# Altium project psat_mboard.PrjPcb
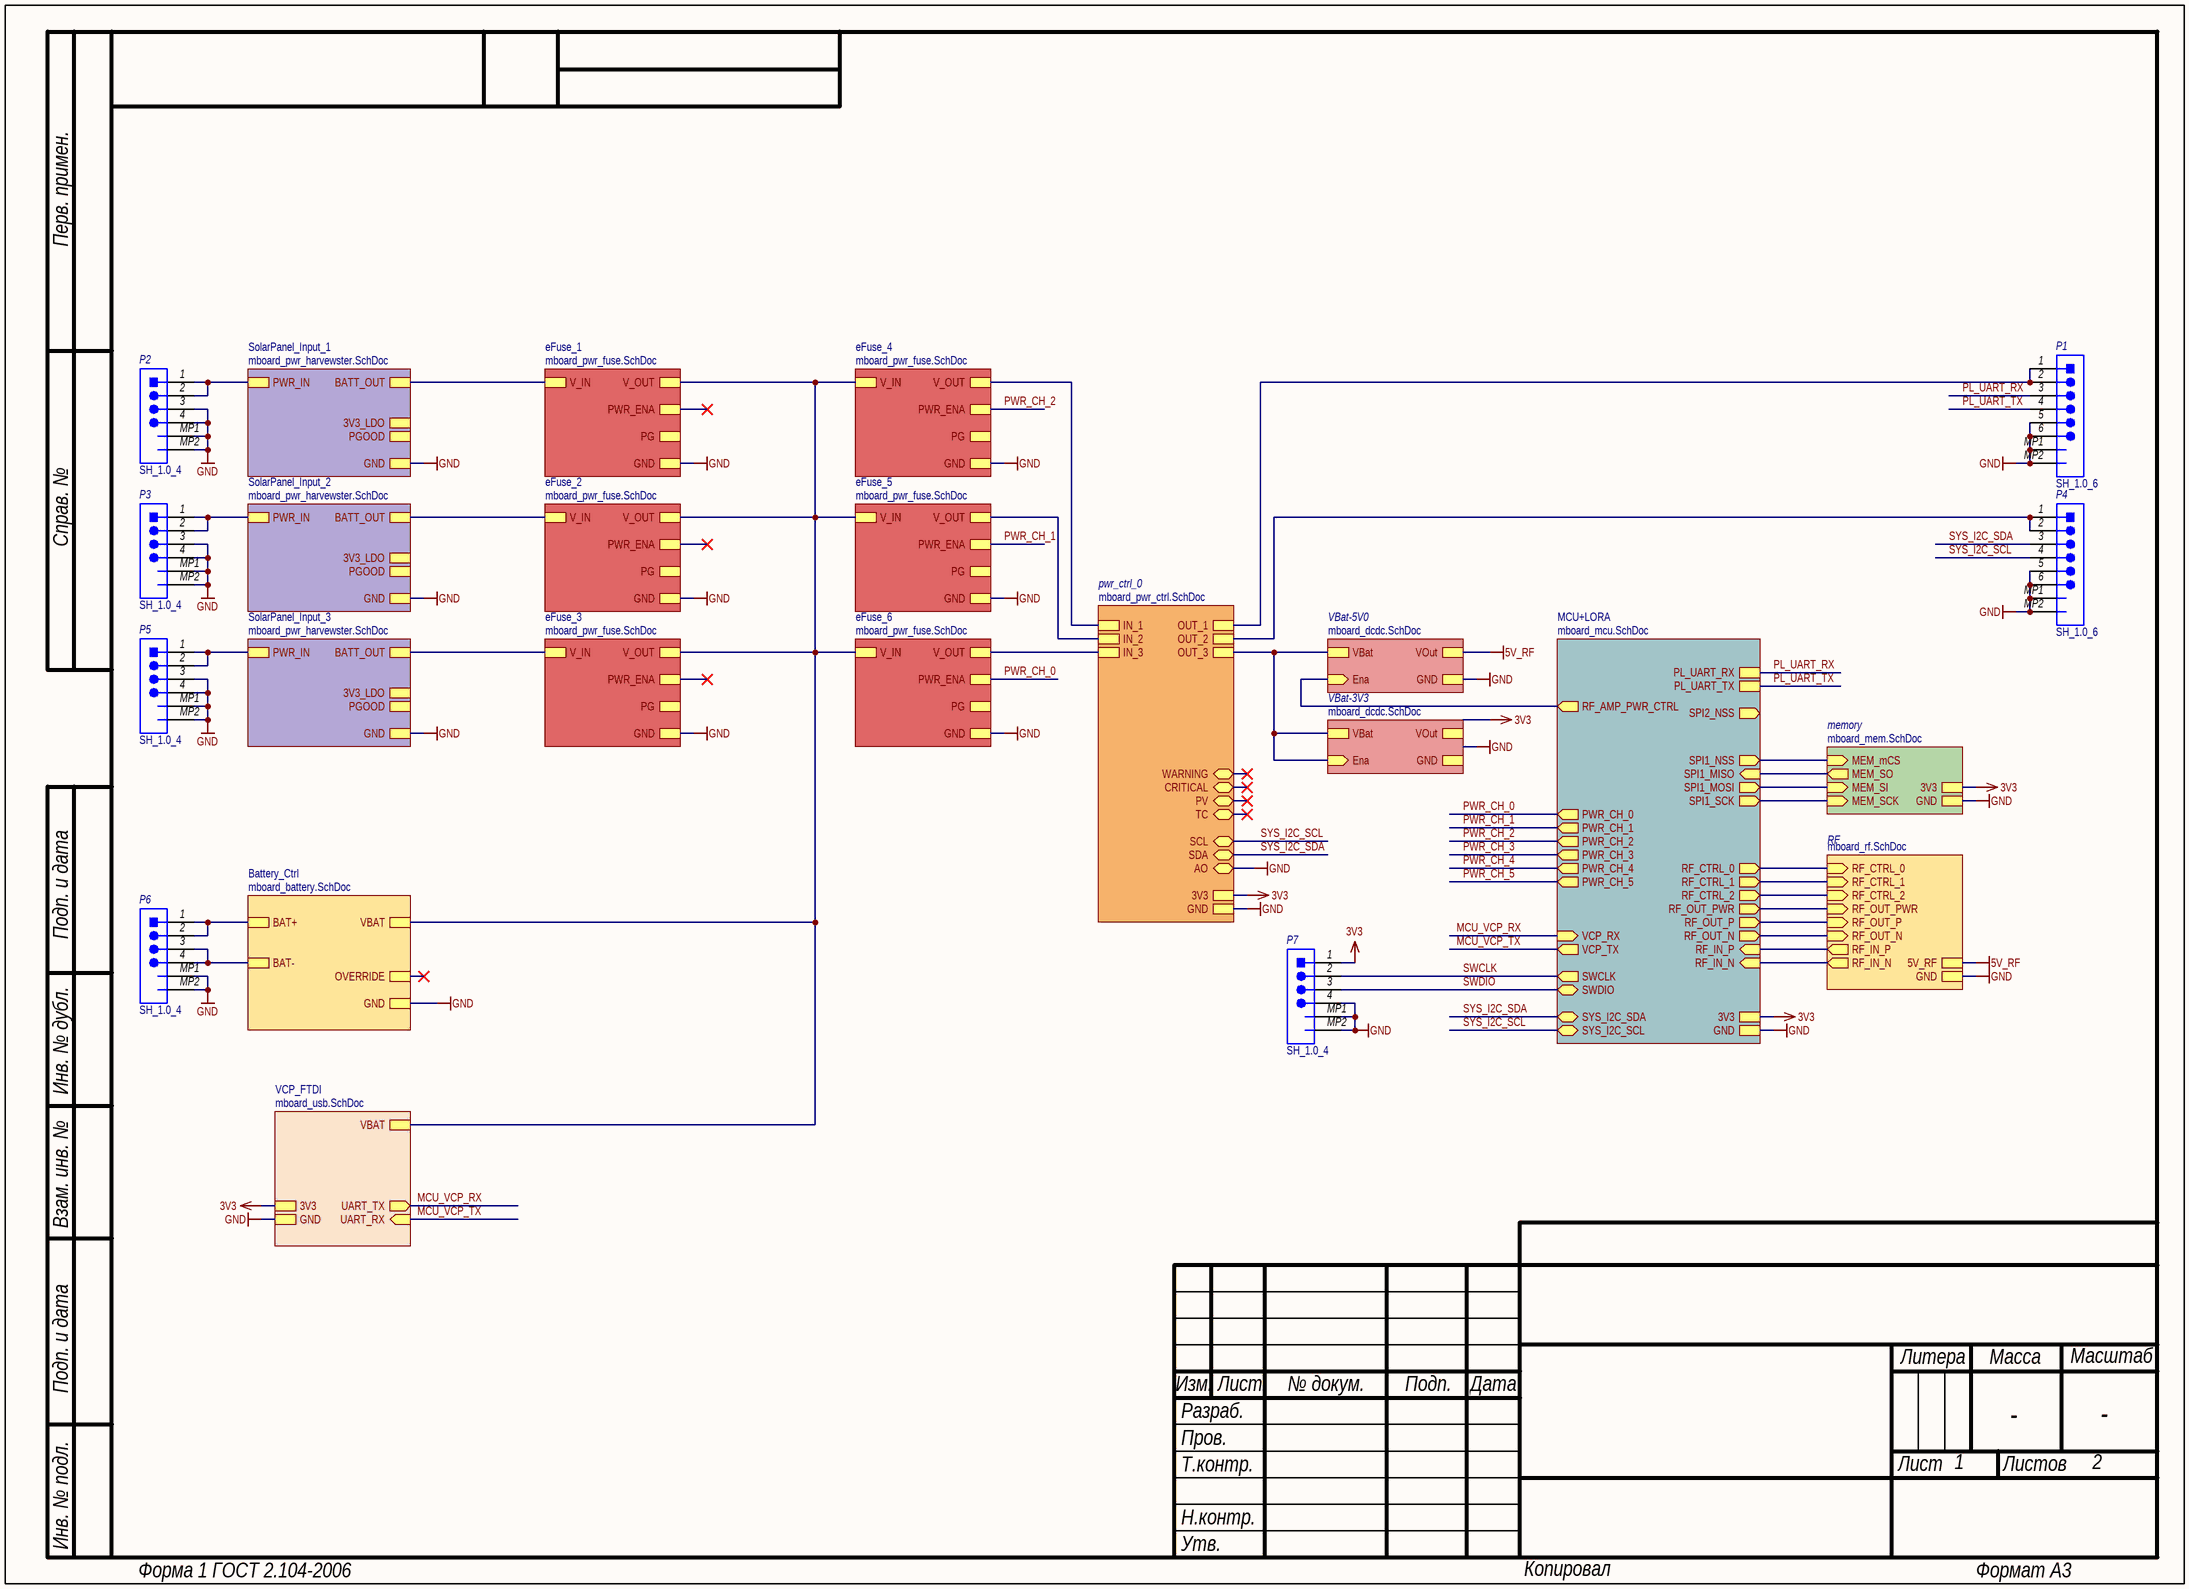
[diagram p0: mboard.SchDoc]
10 sheets, 249 parts. Net scope: hierarchical (ports join the sheet entries above them; power ports are global).
Board file: pwr_pcube.PcbDoc
Sheets:
  mboard.SchDoc
    MCU+LORA = mboard_mcu.SchDoc
    VCP_FTDI = mboard_usb.SchDoc
    SolarPanel_Input_1 = mboard_pwr_harvewster.SchDoc
    Battery_Ctrl = mboard_battery.SchDoc
    SolarPanel_Input_2 = mboard_pwr_harvewster.SchDoc
    SolarPanel_Input_3 = mboard_pwr_harvewster.SchDoc
    eFuse_1 = mboard_pwr_fuse.SchDoc
    eFuse_2 = mboard_pwr_fuse.SchDoc
    eFuse_3 = mboard_pwr_fuse.SchDoc
    eFuse_4 = mboard_pwr_fuse.SchDoc
    eFuse_5 = mboard_pwr_fuse.SchDoc
    eFuse_6 = mboard_pwr_fuse.SchDoc
    RF = mboard_rf.SchDoc
    VBat-5V0 = mboard_dcdc.SchDoc
    VBat-3V3 = mboard_dcdc.SchDoc
    pwr_ctrl_0 = mboard_pwr_ctrl.SchDoc
    memory = mboard_mem.SchDoc

## Sheet mboard.SchDoc: =GlobalProjectName
size 410 x 297 mm; SheetNumber: 1; SheetTotal: 2; PageSetup: Record=PageOptions|CenterHorizontal=True|CenterVertical=True|PrintScale=1.00|XCorrection=1.00|YCorrection=1.00|PrintKind=1|BorderSize=5000000|LeftOffset=0|BottomOffset=0|Orientation=2|PaperLength=1000|PaperWidth=1000|Scale=100|PaperSource=15|PrintQuality=1200|MediaType=1|DitherType=10|PaperKind=A3|PrintScaleMode=1; Weight: -; ScaleFactor: -

### Parts
P1  SH_1.0_6  [SH_1.0_6]
P2  SH_1.0_4  [SH_1.0_6]
P3  SH_1.0_4  [SH_1.0_6]
P4  SH_1.0_6  [SH_1.0_6]
P5  SH_1.0_4  [SH_1.0_6]
P6  SH_1.0_4  [SH_1.0_6]
P7  SH_1.0_4  [SH_1.0_6]

### Sub-sheets
Battery_Ctrl = mboard_battery.SchDoc: GND, BAT+, VBAT, OVERRIDE, BAT-
eFuse_1 = mboard_pwr_fuse.SchDoc: PG, V_IN, PWR_ENA, GND, V_OUT
eFuse_2 = mboard_pwr_fuse.SchDoc: PG, V_IN, PWR_ENA, GND, V_OUT
eFuse_3 = mboard_pwr_fuse.SchDoc: PG, V_IN, PWR_ENA, GND, V_OUT
eFuse_4 = mboard_pwr_fuse.SchDoc: PG, V_IN, PWR_ENA, GND, V_OUT
eFuse_5 = mboard_pwr_fuse.SchDoc: PG, V_IN, PWR_ENA, GND, V_OUT
eFuse_6 = mboard_pwr_fuse.SchDoc: PG, V_IN, PWR_ENA, GND, V_OUT
MCU+LORA = mboard_mcu.SchDoc: 3V3, GND, PWR_CH_1 (out), PWR_CH_0 (out), PL_UART_RX, VCP_TX (out), PWR_CH_2 (out), SPI1_MISO (in), SPI1_SCK (out), PWR_CH_4 (out), PWR_CH_5 (out), PWR_CH_3 (out), VCP_RX (in), PL_UART_TX, SPI1_MOSI (out), SPI1_NSS (out), SWCLK (out), SWDIO (bidir), SPI2_NSS (out), RF_AMP_PWR_CTRL (out), SYS_I2C_SDA (bidir), SYS_I2C_SCL (bidir), RF_IN_P (in), RF_OUT_P (out), RF_CTRL_2 (out), RF_OUT_N (out), RF_CTRL_0 (out), RF_IN_N (in), RF_OUT_PWR (out), RF_CTRL_1 (out)
memory = mboard_mem.SchDoc: GND, MEM_mCS (in), MEM_SO (out), 3V3, MEM_SI (in), MEM_SCK (in)
pwr_ctrl_0 = mboard_pwr_ctrl.SchDoc: IN_1, WARNING (bidir), AO (bidir), OUT_3, IN_3, CRITICAL (bidir), OUT_2, GND, IN_2, TC (bidir), SCL (bidir), SDA (bidir), OUT_1, 3V3, PV (bidir)
RF = mboard_rf.SchDoc: RF_OUT_PWR (in), RF_CTRL_2 (in), RF_CTRL_0 (in), RF_IN_N (out), RF_OUT_P (in), RF_OUT_N (in), RF_CTRL_1 (in), RF_IN_P (out), GND, 5V_RF
SolarPanel_Input_1 = mboard_pwr_harvewster.SchDoc: PGOOD, GND, PWR_IN, BATT_OUT, 3V3_LDO
SolarPanel_Input_2 = mboard_pwr_harvewster.SchDoc: PGOOD, GND, PWR_IN, BATT_OUT, 3V3_LDO
SolarPanel_Input_3 = mboard_pwr_harvewster.SchDoc: PGOOD, GND, PWR_IN, BATT_OUT, 3V3_LDO
VBat-3V3 = mboard_dcdc.SchDoc: VBat, Ena (in), VOut, GND  | DCDC_Name: TPS621221
VBat-5V0 = mboard_dcdc.SchDoc: VBat, Ena (in), VOut, GND  | DCDC_Name: TPS621222
VCP_FTDI = mboard_usb.SchDoc: UART_RX (in), GND, 3V3, VBAT, UART_TX (out)

### Nets
3V3: P7.1 ; sheet MCU+LORA/3V3, sheet VCP_FTDI/3V3, sheet pwr_ctrl_0/3V3, sheet memory/3V3
3V3_LDO: sheet SolarPanel_Input_1/3V3_LDO, sheet SolarPanel_Input_2/3V3_LDO, sheet SolarPanel_Input_3/3V3_LDO
5V_RF: sheet RF/5V_RF, sheet VBat-5V0/VOut
GND: P1.5 P1.6 P1.MP1 P1.MP2 P2.3 P2.4 P2.MP1 P2.MP2 P3.3 P3.4 P3.MP1 P3.MP2 P4.5 P4.6 P4.MP1 P4.MP2 P5.3 P5.4 P5.MP1 P5.MP2 P6.MP1 P6.MP2 P7.4 P7.MP1 P7.MP2 ; sheet MCU+LORA/GND, sheet MCU+LORA/RF_OUT_N, sheet VCP_FTDI/GND, sheet SolarPanel_Input_1/GND, sheet Battery_Ctrl/GND, sheet SolarPanel_Input_2/GND, sheet SolarPanel_Input_3/GND, sheet eFuse_1/GND, sheet eFuse_2/GND, sheet eFuse_3/GND, sheet eFuse_4/GND, sheet eFuse_5/GND, sheet eFuse_6/GND, sheet RF/RF_OUT_N, sheet RF/GND, sheet VBat-5V0/GND, sheet VBat-3V3/GND, sheet pwr_ctrl_0/AO, sheet pwr_ctrl_0/GND, sheet memory/GND
MCU_VCP_RX: sheet MCU+LORA/VCP_RX, sheet VCP_FTDI/UART_TX
MCU_VCP_TX: sheet MCU+LORA/VCP_TX, sheet VCP_FTDI/UART_RX
PL_UART_RX: P1.3 ; sheet MCU+LORA/PL_UART_RX
PL_UART_TX: P1.4 ; sheet MCU+LORA/PL_UART_TX
PWR_CH_0: sheet MCU+LORA/PWR_CH_0, sheet eFuse_6/PWR_ENA
PWR_CH_1: sheet MCU+LORA/PWR_CH_1, sheet eFuse_5/PWR_ENA
PWR_CH_2: sheet MCU+LORA/PWR_CH_2, sheet eFuse_4/PWR_ENA
RF_AMP_PWR_CTRL: sheet MCU+LORA/RF_AMP_PWR_CTRL, sheet VBat-5V0/Ena
RF_CTRL_0: sheet MCU+LORA/RF_CTRL_0, sheet RF/RF_CTRL_0
RF_CTRL_1: sheet MCU+LORA/RF_CTRL_1, sheet RF/RF_CTRL_1
RF_CTRL_2: sheet MCU+LORA/RF_CTRL_2, sheet RF/RF_CTRL_2
RF_IN_N: sheet MCU+LORA/RF_IN_N, sheet RF/RF_IN_N
RF_IN_P: sheet MCU+LORA/RF_IN_P, sheet RF/RF_IN_P
SPI1_MISO: sheet MCU+LORA/SPI1_MISO, sheet memory/MEM_SO
SPI1_MOSI: sheet MCU+LORA/SPI1_MOSI, sheet memory/MEM_SI
SPI1_NSS: sheet MCU+LORA/SPI1_NSS, sheet memory/MEM_mCS
SPI1_SCK: sheet MCU+LORA/SPI1_SCK, sheet memory/MEM_SCK
SWCLK: P7.2 ; sheet MCU+LORA/SWCLK
SWDIO: P7.3 ; sheet MCU+LORA/SWDIO
SYS_I2C_SCL: P4.4 ; sheet MCU+LORA/SYS_I2C_SCL, sheet pwr_ctrl_0/SCL
SYS_I2C_SDA: P4.3 ; sheet MCU+LORA/SYS_I2C_SDA, sheet pwr_ctrl_0/SDA
NetC7_2: P6.3 P6.4 ; sheet Battery_Ctrl/BAT-
NetC8#1_1: P2.1 P2.2 ; sheet SolarPanel_Input_1/PWR_IN
NetC9#2_2: sheet SolarPanel_Input_1/BATT_OUT, sheet eFuse_1/V_IN
NetC10#1_2: sheet VCP_FTDI/VBAT, sheet Battery_Ctrl/VBAT, sheet eFuse_1/V_OUT, sheet eFuse_2/V_OUT, sheet eFuse_3/V_OUT, sheet eFuse_4/V_IN, sheet eFuse_5/V_IN, sheet eFuse_6/V_IN
NetC13#2_1: P3.1 P3.2 ; sheet SolarPanel_Input_2/PWR_IN
NetC14#2_2: sheet SolarPanel_Input_2/BATT_OUT, sheet eFuse_2/V_IN
NetC17#2_1: sheet MCU+LORA/RF_OUT_PWR, sheet RF/RF_OUT_PWR
NetC18#1_1: P5.1 P5.2 ; sheet SolarPanel_Input_3/PWR_IN
NetC19#1_2: sheet SolarPanel_Input_3/BATT_OUT, sheet eFuse_3/V_IN
NetL7#1_2: sheet MCU+LORA/RF_OUT_P, sheet RF/RF_OUT_P
NetL7#2_1: sheet VBat-5V0/VBat, sheet VBat-3V3/VBat, sheet VBat-3V3/Ena, sheet pwr_ctrl_0/OUT_3
NetP1_1: P1.1 P1.2 ; sheet pwr_ctrl_0/OUT_1
NetP4_1: P4.1 P4.2 ; sheet pwr_ctrl_0/OUT_2
NetP6_1: P6.1 P6.2 ; sheet Battery_Ctrl/BAT+
NetR9_2: sheet eFuse_4/V_OUT, sheet pwr_ctrl_0/IN_1
NetR10_2: sheet eFuse_5/V_OUT, sheet pwr_ctrl_0/IN_2
NetR11_2: sheet eFuse_6/V_OUT, sheet pwr_ctrl_0/IN_3

### Notes on the sheet
- Перв. примен.
- Справ. №
- Подп. и дата
- Инв. № дубл.
- Взам. инв. №
- Изм.
- Разраб.
- Лист
- № докум.
- Подп.
- Дата
- Литера
- Масса
- Масштаб
- Пров.
- Т.контр.
- Листов
- Н.контр.
- Утв.
- Инв. № подл.
- Форма 1 ГОСТ 2.104-2006
- Копировал
- Формат А3

### Library data of the parts
P1 P4 = SH_1.0_6: JST SH1.0, 1.0 mm pitch/Disconnactable crimp style connectors; Потребление, Вт: 0.0; Назначение: JST SH1.0, 1.0 mm pitch/Disconnactable crimp style connectors; ComponentLink1Description: DataSheet; ComponentLink1URL: https://www.jst-mfg.com/product/pdf/eng/eSH.pdf; Наименование: SH_1.0_6
P2 P3 P5-P7 = SH_1.0_4: JST SH1.0, 1.0 mm pitch/Disconnactable crimp style connectors; Потребление, Вт: 0.0; Назначение: JST SH1.0, 1.0 mm pitch/Disconnactable crimp style connectors; ComponentLink1Description: DataSheet; ComponentLink1URL: https://www.jst-mfg.com/product/pdf/eng/eSH.pdf; Наименование: SH_1.0_4

## Sheet mboard_mcu.SchDoc: =GlobalProjectName
size 410 x 297 mm; SheetNumber: 2; SheetTotal: 2; PageSetup: Record=PageOptions|CenterHorizontal=True|CenterVertical=True|PrintScale=1.00|XCorrection=1.00|YCorrection=1.00|PrintKind=1|BorderSize=5000000|LeftOffset=0|BottomOffset=0|Orientation=2|PaperLength=1000|PaperWidth=1000|Scale=100|PaperSource=15|PrintQuality=1200|MediaType=1|DitherType=10|PaperKind=A3|PrintScaleMode=1; Weight: -; ScaleFactor: -
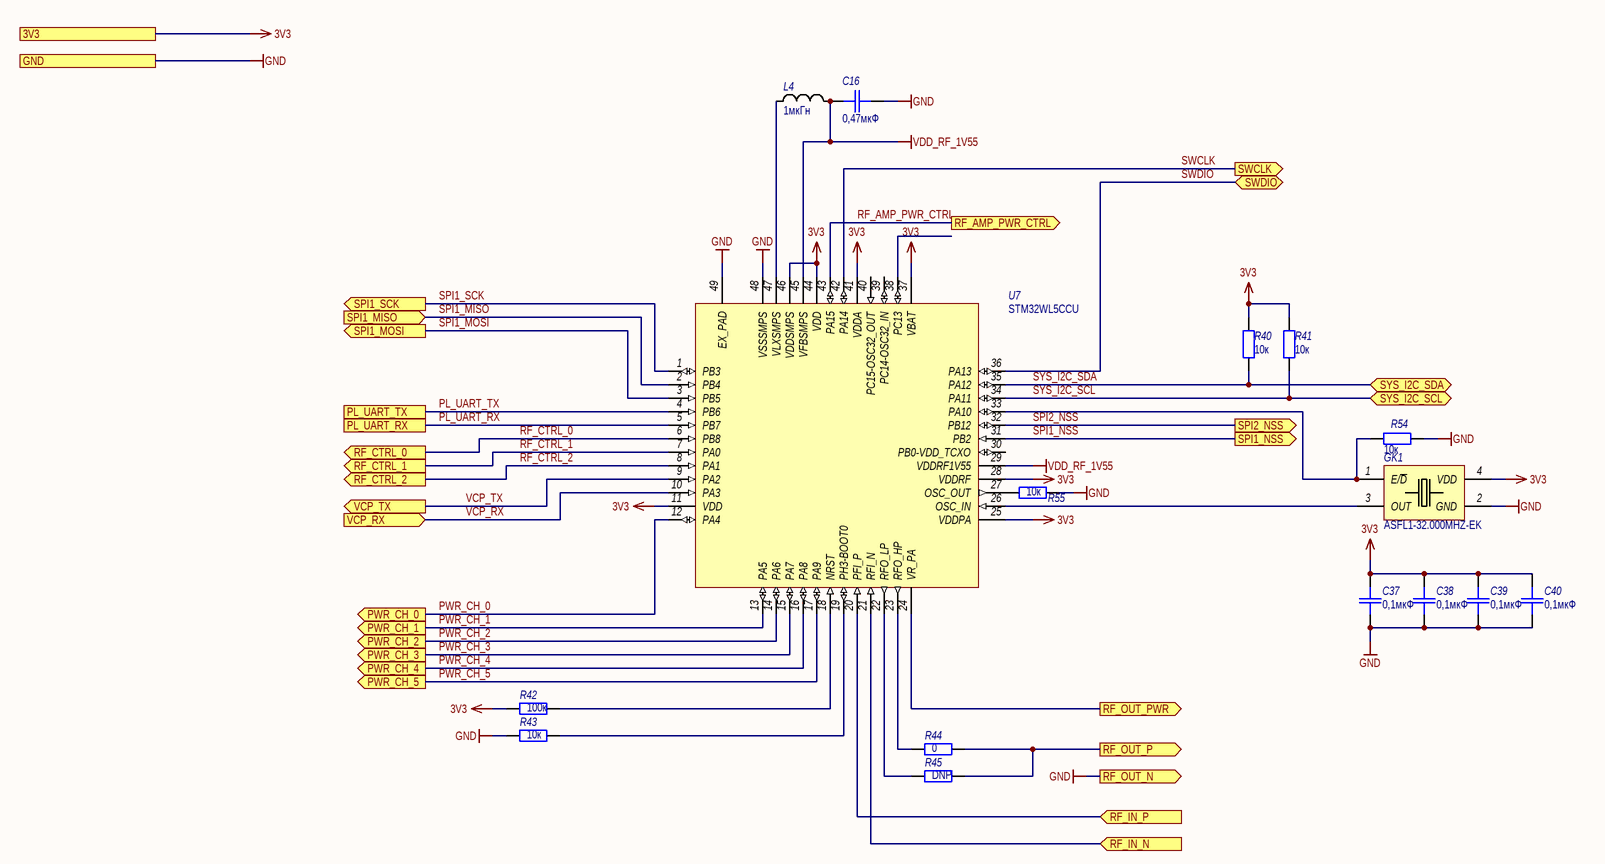
[diagram p1: mboard_mcu.SchDoc]

### Parts
(Parts that share a designator on the sheet are numbered #1, #2 ... from top to bottom, then left to right.)
C16#1  value 0,47мкФ  [SMD_C0402]  (hidden comment: K10-79)
C37  value 0,1мкФ  [SMD_C0402]  (hidden comment: K10-79)
C38  value 0,1мкФ  [SMD_C0402]  (hidden comment: K10-79)
C39  value 0,1мкФ  [SMD_C0402]  (hidden comment: K10-79)
C40  value 0,1мкФ  [SMD_C0402]  (hidden comment: K10-79)
GK1  ASFL1-32.000MHZ-EK  [SMD_3025_Crustal_Oscilator]
L4#1  1мкГн  [SMD_0805]
R40#1  value 10к  [SMD_0805]  (hidden comment: OSM R1-12)
R41#1  value 10к  [SMD_0805]  (hidden comment: OSM R1-12)
R42#1  value 100к  [SMD_0805]  (hidden comment: OSM R1-12)
R43#1  value 10к  [SMD_0805]  (hidden comment: OSM R1-12)
R44#1  value 0  [SMD_0805]  (hidden comment: OSM R1-12)
R45#1  value DNP  [SMD_0805]  (hidden comment: OSM R1-12)
R54#1  value 10к  [SMD_0805]  (hidden comment: OSM R1-12)
R55#1  value 10к  [SMD_0805]  (hidden comment: OSM R1-12)
U7  STM32WL5CCU  [UQFNPN48]

### Ports
3V3, GND, PL_UART_RX, PL_UART_TX, PWR_CH_0 (out), PWR_CH_1 (out), PWR_CH_2 (out), PWR_CH_3 (out), PWR_CH_4 (out), PWR_CH_5 (out), RF_AMP_PWR_CTRL (out), RF_CTRL_0 (out), RF_CTRL_1 (out), RF_CTRL_2 (out), RF_IN_N (in), RF_IN_P (in), RF_OUT_N (out), RF_OUT_P (out), RF_OUT_PWR (out), SPI1_MISO (in), SPI1_MOSI (out), SPI1_NSS (out), SPI1_SCK (out), SPI2_NSS (out), SWCLK (out), SWDIO (bidir), SYS_I2C_SCL (bidir), SYS_I2C_SDA (bidir), VCP_RX (in), VCP_TX (out)

### Nets
3V3: C37.1 C38.1 C39.1 C40.1 GK1.4(VDD) R40#1.2 R41#1.2 R42#1.1 U7.11(VDD) U7.25(VDDPA) U7.28(VDDRF) U7.37(VBAT) U7.41(VDDA) U7.44(VDD) U7.46(VDDSMPS) ; port 3V3
GND: C16#1.2 C37.2 C38.2 C39.2 C40.2 GK1.2(GND) R43#1.1 R54#1.1 R55#1.2 U7.48(VSSSMPS) U7.49(EX_PAD) ; port GND, port RF_OUT_N
VDD_RF_1V55: C16#1.1 L4#1.2 U7.29(VDDRF1V55) U7.45(VFBSMPS)
PL_UART_RX: U7.5(PB7) ; port PL_UART_RX
PL_UART_TX: U7.4(PB6) ; port PL_UART_TX
PWR_CH_0: U7.12(PA4) ; port PWR_CH_0
PWR_CH_1: U7.13(PA5) ; port PWR_CH_1
PWR_CH_2: U7.14(PA6) ; port PWR_CH_2
PWR_CH_3: U7.15(PA7) ; port PWR_CH_3
PWR_CH_4: U7.16(PA8) ; port PWR_CH_4
PWR_CH_5: U7.17(PA9) ; port PWR_CH_5
RF_AMP_PWR_CTRL: U7.43(PA15) ; port RF_AMP_PWR_CTRL
RF_CTRL_0: U7.6(PB8) ; port RF_CTRL_0
RF_CTRL_1: U7.7(PA0) ; port RF_CTRL_1
RF_CTRL_2: U7.8(PA1) ; port RF_CTRL_2
RF_IN_N: U7.21(RFI_N) ; port RF_IN_N
RF_IN_P: U7.20(PFI_P) ; port RF_IN_P
SPI1_MISO: U7.2(PB4) ; port SPI1_MISO
SPI1_MOSI: U7.3(PB5) ; port SPI1_MOSI
SPI1_NSS: U7.31(PB2) ; port SPI1_NSS
SPI1_SCK: U7.1(PB3) ; port SPI1_SCK
SPI2_NSS: U7.32(PB12) ; port SPI2_NSS
SWCLK: U7.42(PA14) ; port SWCLK
SWDIO: U7.36(PA13) ; port SWDIO
SYS_I2C_SCL: R41#1.1 U7.34(PA11) ; port SYS_I2C_SCL
SYS_I2C_SDA: R40#1.1 U7.35(PA12) ; port SYS_I2C_SDA
VCP_RX: U7.10(PA3) ; port VCP_RX  [project net MCU_VCP_RX]
VCP_TX: U7.9(PA2) ; port VCP_TX  [project net MCU_VCP_TX]
NetC17#2_1: U7.24(VR_PA) ; port RF_OUT_PWR
NetGK1_1: GK1.1(E/~{D}) R54#1.2 U7.33(PA10)
NetGK1_3: GK1.3(OUT) U7.26(OSC_IN)
NetL4#1_1: L4#1.1 U7.47(VLXSMPS)
NetL7#1_2: R44#1.2 R45#1.2 ; port RF_OUT_P
NetR42#1_2: R42#1.2 U7.18(NRST)
NetR43#1_2: R43#1.2 U7.19(PH3-BOOT0)
NetR44#1_1: R44#1.1 U7.23(RFO_HP)
NetR45#1_1: R45#1.1 U7.22(RFO_LP)
NetR55#1_1: R55#1.1 U7.27(OSC_OUT)

Not connected (* = marked no-connect by the designer): U7 30(PB0-VDD_TCXO) 38(PC13) 39(PC14-OSC32_IN) 40(PC15-OSC32_OUT)

### Notes on the sheet
- Подп. и дата
- Инв. № дубл.
- Взам. инв. №
- Инв. № подл.
- Изм.
- Лист
- № докум.
- Подп.
- Дата
- Форма 2а ГОСТ 2.104-2006
- Копировал
- Формат А3

### Library data of the parts
C16#1 C37-C40 = Capacitor: Назначение: SMD-конденсатор; Наименование: К10-79; Потребление, Вт: 0; Точность: %; Напряжение: В; Диэлектрик: *
GK1 = Crystal_Oscillator_2: Crystall oscillator, CMOS, 3.3V, SMD3025; Назначение: XO SMD 3.3V 32.000MHZ 3.2X5MM; Потребление, Вт: 0,165; ComponentLink1Description: DataSheet; ComponentLink1URL: https://abracon.com/Oscillators/ASFL1.pdf; Наименование: ASFL1-32.000MHZ-EK
L4#1 = Inductor: Наименование: Индуктивность; Назначение: SMD-индуктивность; Потребление, Вт: 0,010; Value: 1мкГн
R40#1 R41#1 R42#1 R43#1 R44#1 R45#1 R54#1 R55#1 = Resistor: Наименование: ОСМ Р1-12; Назначение: SMD-резистор; Потребление, Вт: 0,001; Точность: %
U7 = STM32WL5CCU: Multiprotocol Wireless 32-bit MCU with LPWAN Sub-GHz radio solution; Потребление, Вт: 0.3; ComponentLink1Description: Datasheet; ComponentLink1URL: https://www.st.com/resource/en/datasheet/stm32wle5c8.pdf; Назначение: Multiprotocol Wireless 32-bit MCU with LPWAN Sub-GHz radio solution; Наименование: STM32WL5CCU

## Sheet mboard_usb.SchDoc: =GlobalProjectName
size 209 x 297 mm; SheetNumber: Лист; SheetTotal: Листов; PageSetup: Record=PageOptions|CenterHorizontal=True|CenterVertical=True|PrintScale=1.00|XCorrection=1.00|YCorrection=1.00|PrintKind=1|BorderSize=5000000|LeftOffset=0|BottomOffset=0|Orientation=2|PaperLength=1000|PaperWidth=1000|Scale=100|PaperSource=15|PrintQuality=1200|MediaType=1|DitherType=10|PaperKind=A3|PrintScaleMode=1; Weight: -; ScaleFactor: -
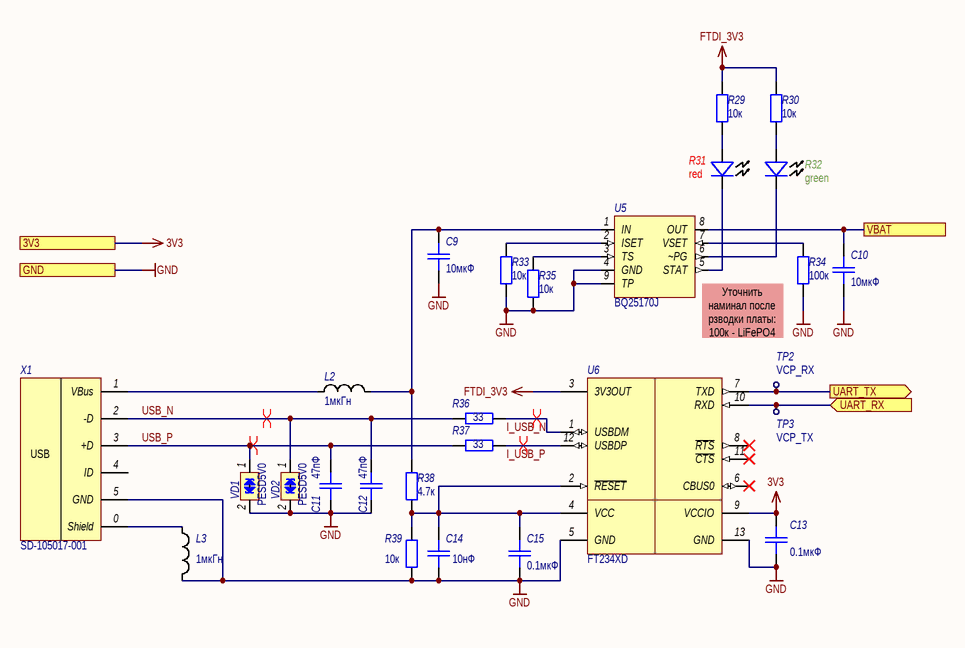
[diagram p2: mboard_usb.SchDoc]

### Parts
(Parts that share a designator on the sheet are numbered #1, #2 ... from top to bottom, then left to right.)
C9#1  10мкФ  [SMD_C0603]
C10#1  10мкФ  [SMD_C0603]
C11#1  47пФ  [SMD_C0402]
C12#1  47пФ  [SMD_C0402]
C13#1  0.1мкФ  [SMD_C0402]
C14#1  10нФ  [SMD_C0402]
C15#1  0.1мкФ  [SMD_C0402]
L2#1  1мкГн  [SMD_0805]
L3#1  1мкГн  [SMD_0805]
R29#1  10к  [SMD_0603]
R30#1  10к  [SMD_0603]
R31#1  value red  [LED_0402_RED]  (hidden comment: LED)
R32#1  value green  [LED_0402_RED]  (hidden comment: LED)
R33#1  10к  [SMD_0603]
R34#1  100к  [SMD_0603]
R35#1  10к  [SMD_0603]
R36#1  33  [SMD_0603]
R37#1  33  [SMD_0603]
R38#1  4.7к  [SMD_0603]
R39#1  10к  [SMD_0603]
TP2#1  VCP_RX  [TestPoint]
TP3#1  VCP_TX  [TestPoint]
U5#1  BQ25170J
U6  FT234XD  [DFN-12]
VD1  PESD5V0  [SOD-323]
VD2  PESD5V0  [SOD-323]
X1  Наименование: SD-105017-001  [MicroUSB-Molex-105017]  (hidden comment: mico-BF)

### Ports
3V3, GND, UART_RX (in), UART_TX (out), VBAT

### Nets
3V3: C13#1.2 U6.9(VCCIO) ; port 3V3
FTDI_3V3: R29#1.1 R30#1.1 U6.3(3V3OUT)
GND: C9#1.1 C10#1.1 C11#1.1 C12#1.1 C13#1.1 C14#1.1 C15#1.1 L3#1.2 R33#1.2 R34#1.2 R35#1.2 R39#1.1 U5#1.4(GND) U5#1.9(TP) U6.5(GND) U6.13(GND) VD1.2(cathode_2) VD2.2(cathode_2) X1.5(GND) ; port GND
I_USB_N: R36#1.1 U6.1(USBDM)
I_USB_P: R37#1.1 U6.12(USBDP)
MCU_VCP_RX: TP2#1.0(TP) U6.7(TXD) ; port UART_TX
MCU_VCP_TX: TP3#1.0(TP) U6.10(RXD) ; port UART_RX
USB_N: C12#1.2 R36#1.2 VD2.1(cathode_1) X1.2(-D)
USB_P: C11#1.2 R37#1.2 VD1.1(cathode_1) X1.3(+D)
NetC9#1_2: C9#1.2 L2#1.2 R38#1.1 U5#1.1(IN)
NetC10#1_2: C10#1.2 U5#1.8(OUT) ; port VBAT
NetC14#1_2: C14#1.2 C15#1.2 R38#1.2 R39#1.2 U6.2(~{RESET}) U6.4(VCC)
NetL2#1_1: L2#1.1 X1.1(VBus)
NetL3#1_1: L3#1.1 X1.0(Shield)
NetR29#1_2: R29#1.2 R31#1.1(A)
NetR30#1_2: R30#1.2 R32#1.1(A)
NetR31#1_2: R31#1.2(K) U5#1.5(STAT)
NetR32#1_2: R32#1.2(K) U5#1.6(~PG)
NetR33#1_1: R33#1.1 U5#1.2(ISET)
NetR34#1_1: R34#1.1 U5#1.7(VSET)
NetR35#1_1: R35#1.1 U5#1.3(TS)

Not connected (* = marked no-connect by the designer): U6 6(CBUS0)* 8(~{RTS})* 11(~{CTS})*; X1 4(ID)

### Layout directives
differential pair: I_USB_N, I_USB_P, USB_N, USB_P

### Notes on the sheet
- (near U5#1) Уточнить наминал после рзводки платы:
  100к - LiFePO4 3V5
- Подп. и дата
- Инв. № дубл.
- Взам. инв. №
- Инв. № подл.
- Изм.
- Лист
- № докум.
- Подп.
- Дата
- Форма 2а ГОСТ 2.104-2006
- Копировал
- Формат А4
- (in symbol MicroUSB) USB

### Library data of the parts
C9#1 C10#1 C11#1 C12#1 C13#1 C14#1 C15#1 = Capacitor: Назначение: SMD-конденсатор; Наименование: Конденсатор; Потребление, Вт: 0
  C9 C10: Value: 10мкФ
  C11 C12: Value: 47пФ
  C13 C15: Value: 0.1мкФ
  C14: Value: 10нФ
L2#1 L3#1 = Inductor: as L4#1 on sheet mboard_mcu; Value: 1мкГн
R29#1 R30#1 R33#1 R34#1 R35#1 R36#1 R37#1 R38#1 R39#1 = Resistor: PE1206DRM470R01L; Наименование: Резистор; Назначение: SMD-резистор; Потребление, Вт: 0,001
  R29 R30 R33 R35 R39: Value: 10к
  R34: Value: 100к
  R36 R37: Value: 33
  R38: Value: 4.7к
R31#1 R32#1 = LED: Назначение: LED 0402 red; Наименование: SMD-LED; Потребление, Вт: 0,01
TP2#1 TP3#1 = TP: Наименование: Точка проверки; Назначение: Контроль параметров платы
  TP2: TP_Name: VCP_RX
  TP3: TP_Name: VCP_TX
U5#1 = BQ25170J: 800-mA JEITA-Compliant Linear Battery Charger for 1-Cell Li-Ion, LiPolymer, and LiFePO4; Потребление, Вт: 0,001; ComponentLink1Description: DataSheet; ComponentLink1URL: https://www.ti.com/lit/ds/symlink/bq25170j.pdf?ts=1636221072761&ref_url=https%253A%252F%252Fwww.ti.com%252Fproduct%252FBQ25170J; Назначение: 800-mA JEITA-Compliant Linear Battery Charger for 1-Cell Li-Ion, LiPolymer, and LiFePO4; Наименование: BQ25170J
U6 = FT234XD: USB TO BASIC UART IC; Потребление, Вт: 0.03; Назначение: USB TO BASIC UART IC; ComponentLink1Description: DataSheet; ComponentLink1URL: https://ftdichip.com/wp-content/uploads/2020/08/DS_FT234XD.pdf; Supplier 1: Newark; Supplier Part Number 1: 53X3171; Наименование: FT234XD
VD1 VD2 = PESDxL1BA: Low capacitance bidirectional ESD protection diodes; Назначение: ESD защитные диоды; Потребление, Вт: 0.0; Наименование: PESDxL1BA; ComponentLink1Description: DataSheet; ComponentLink1URL: https://static.chipdip.ru/lib/635/DOC005635911.pdf
X1 = MicroUSB: MicroUSB bottom mount receptacle, B-type; Потребление, Вт: 0; Назначение: MicroUSB bottom mount receptacle, B-type; DataSheet: *

## Sheet mboard_pwr_harvewster.SchDoc: =GlobalProjectName
size 209 x 297 mm; SheetNumber: Лист; SheetTotal: Листов; PageSetup: Record=PageOptions|CenterHorizontal=True|CenterVertical=True|PrintScale=1.00|XCorrection=1.00|YCorrection=1.00|PrintKind=1|BorderSize=5000000|LeftOffset=0|BottomOffset=0|Orientation=2|PaperLength=1000|PaperWidth=1000|Scale=100|PaperSource=15|PrintQuality=1200|MediaType=1|DitherType=10|PaperKind=A3|PrintScaleMode=1; Weight: -; ScaleFactor: -
Used 3 times, as channels SolarPanel_Input_1, SolarPanel_Input_2, SolarPanel_Input_3. Parts and nets are listed once, with the designators drawn on the sheet.
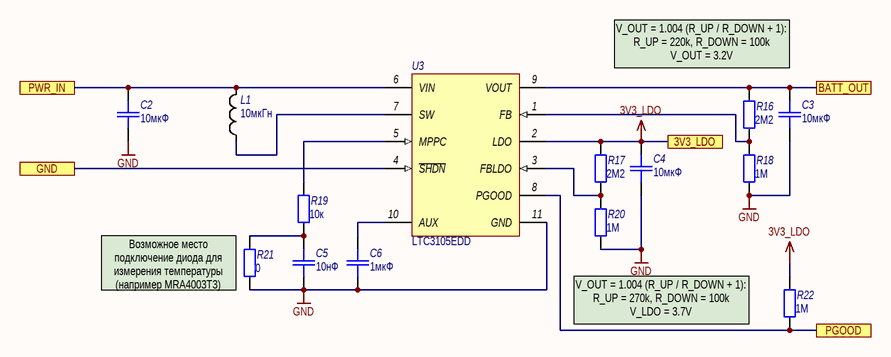
[diagram p3: mboard_pwr_harvewster.SchDoc]

### Parts
C2  10мкФ  [SMD_C0603]
C3  10мкФ  [SMD_C0603]
C4  10мкФ  [SMD_C0603]
C5  10нФ  [SMD_C0603]
C6  1мкФ  [SMD_C0603]
L1  value 10мкГн  [INDUCTOR-4x4]  (hidden comment: LPS4018-223ML)
R16  2M2  [SMD_0603]
R17  2M2  [SMD_0603]
R18  1M  [SMD_0603]
R19  10к  [SMD_0603]
R20  1M  [SMD_0603]
R21  0  [SMD_0603]
R22  1M  [SMD_0603]
U3  LTC3105EDD  [LFQC-10_3x3]

### Ports
3V3_LDO, BATT_OUT, GND, PGOOD, PWR_IN

### Nets
3V3_LDO: C4.2 R17.2 R22.2 U3.2(LDO) ; port 3V3_LDO
GND: C2.2 C3.1 C4.1 C5.2 C6.2 R18.1 R20.1 R21.1 U3.11(GND)
BATT_OUT: C3.2 R16.2 U3.9(VOUT) ; port BATT_OUT
GND: U3.4(~{SHDN}) ; port GND  [a separate net that carries the same name]
PGOOD: R22.1 U3.8(PGOOD) ; port PGOOD
PWR_IN: C2.1 L1.2 U3.6(VIN) ; port PWR_IN
NetC5_1: C5.1 R19.1 R21.2
NetC6_1: C6.1 U3.10(AUX)
NetL1_1: L1.1 U3.7(SW)
NetR16_1: R16.1 R18.2 U3.1(FB)
NetR17_1: R17.1 R20.2 U3.3(FBLDO)
NetR19_2: R19.2 U3.5(MPPC)

### Channels
SolarPanel_Input_1: designators C2=C8#1 C3=C9#2 C4=C10#2 C5=C11#2 C6=C12#2 L1=L2#2 R16=R39#2 R17=R40#2 R18=R41#2 R19=R42#2 R20=R43#2 R21=R44#2 R22=R45#2 U3=U3_SolarPanel_Input_1; ports 3V3_LDO=3V3_LDO BATT_OUT=NetC9#2_2 GND=GND PGOOD=NetR45#2_1 PWR_IN=NetC8#1_1
SolarPanel_Input_2: designators C2=C13#2 C3=C14#2 C4=C15#2 C5=C16#2 C6=C17#1 L1=L3#2 R16=R46#1 R17=R47#1 R18=R48#1 R19=R49#1 R20=R50#1 R21=R51#1 R22=R52#1 U3=U3_SolarPanel_Input_2; ports 3V3_LDO=3V3_LDO BATT_OUT=NetC14#2_2 GND=GND PGOOD=NetR52#1_1 PWR_IN=NetC13#2_1
SolarPanel_Input_3: designators C2=C18#1 C3=C19#1 C4=C20#1 C5=C21#1 C6=C22#1 L1=L4#2 R16=R53#1 R17=R54#2 R18=R55#2 R19=R56 R20=R57 R21=R58 R22=R59 U3=U3_SolarPanel_Input_3; ports 3V3_LDO=3V3_LDO BATT_OUT=NetC19#1_2 GND=GND PGOOD=NetR59_1 PWR_IN=NetC18#1_1

### Notes on the sheet
- V_OUT = 1.004 (R_UP / R_DOWN + 1):
  R_UP = 220k, R_DOWN = 100k
  V_OUT = 3.2V
- (near R21) Возможное место подключение диода для измерения температуры (например MRA4003T3)
- V_OUT = 1.004 (R_UP / R_DOWN + 1):
  R_UP = 270k, R_DOWN = 100k
  V_LDO = 3.7V
- Подп. и дата
- Инв. № дубл.
- Взам. инв. №
- Инв. № подл.
- Изм.
- Лист
- № докум.
- Подп.
- Дата
- Форма 2а ГОСТ 2.104-2006
- Копировал
- Формат А4

### Library data of the parts
C2-C6 = Capacitor: as C9#1 on sheet mboard_usb
  C2-C4: Value: 10мкФ
  C5: Value: 10нФ
  C6: Value: 1мкФ
L1 = Inductor: Наименование: LPS4018-103ML; Назначение: SMD-индуктивность; Потребление, Вт: 0,010
R16-R22 = Resistor: Наименование: Резистор; Назначение: SMD-резистор; Потребление, Вт: 0,001
  R16 R17: Value: 2M2
  R18 R20 R22: Value: 1M
  R19: Value: 10к
  R21: Value: 0
U3 = LTC3105EDD: 400 mA Step-Up DC/DC Converter with Maximum Power Point Control and 250 mV Start-Up, 10-pin SON (DD-10), -40 to 85 degC, Pb-Free, Tape and Reel; PartNumber: LTC3105EDD#TRPBF; Manufacturer: Linear Technology; Topology: Boost; Vout Max(V): 5.25; Vin Min(V): 0.225; Number of Outputs: 1; Vin Max(V): 5; Energy Source: Solar; Назначение: 400 mA Step-Up DC/DC Converter with MPPЕ Control and 250 mV Start-Up; Потребление, Вт: 0.001; ComponentLink3Description: Package Specification; Code_JEDEC: MO-229; PackageDescription: 10-Pin Plastic DFN, Body 3 x 3 mm, Pitch 0.5 mm; Packing: Tape and Reel; Mounting Technology: Surface Mount; PackageVersion: Rev. C, 06/2010; ComponentLink1Description: Manufacturer URL; DatasheetVersion: Rev. A; ComponentLink2Description: Datasheet; ComponentLink2URL: http://cds.linear.com/docs/en/datasheet/3105fa.pdf; ComponentLink1URL: http://www.linear.com/; RoHS: TRUE; PackageReference: DD-10; ComponentLink3URL: http://cds.linear.com/docs/en/packaging/DFN_10_05-08-1699.pdf; Наименование: LTC3105EDD

## Sheet mboard_battery.SchDoc: =GlobalProjectName
size 209 x 297 mm; SheetNumber: Лист; SheetTotal: Листов; PageSetup: Record=PageOptions|CenterHorizontal=True|CenterVertical=True|PrintScale=1.00|XCorrection=1.00|YCorrection=1.00|PrintKind=1|BorderSize=5000000|LeftOffset=0|BottomOffset=0|Orientation=2|PaperLength=1000|PaperWidth=1000|Scale=100|PaperSource=15|PrintQuality=1200|MediaType=1|DitherType=10|PaperKind=A3|PrintScaleMode=1; Weight: -; ScaleFactor: -
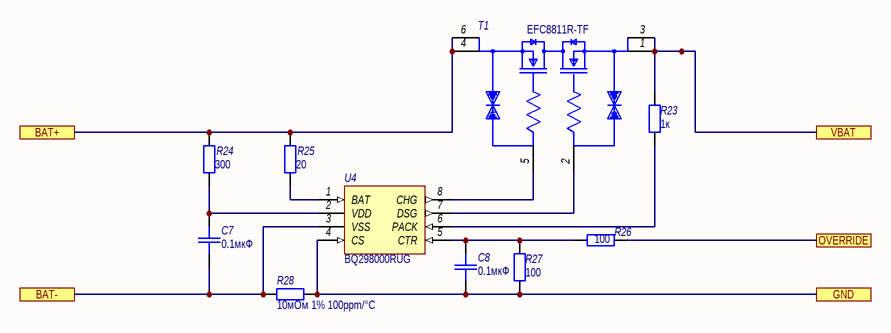
[diagram p4: mboard_battery.SchDoc]

### Parts
(Parts that share a designator on the sheet are numbered #1, #2 ... from top to bottom, then left to right.)
C7  0.1мкФ  [SMD_C0603]
C8#2  0.1мкФ  [SMD_C0603]
R23#1  1к  [SMD_0603]
R24#1  300  [SMD_0603]
R25#1  20  [SMD_0603]
R26#1  100  [SMD_0603]
R27#1  100  [SMD_0603]
R28#1  10мОм 1% 100ppm/°C  [SMD_0805]
T1  EFC8811R-TF  [FP-568AL-MFG]
U4#1  BQ298000RUG  [X2QFN-8]

### Ports
BAT+, BAT-, GND, OVERRIDE, VBAT

### Nets
GND: C8#2.2 R27#1.2 R28#1.2 U4#1.4(CS) ; port GND
NetC7_1: C7.1 R24#1.1 U4#1.2(VDD)
NetC7_2: C7.2 R28#1.1 U4#1.3(VSS) ; port BAT-
NetC8#2_1: C8#2.1 R26#1.2 R27#1.1 U4#1.5(CTR)
NetC10#1_2: R23#1.1 T1.1(SOURCE1) T1.3(SOURCE1) ; port VBAT
NetP6_1: R24#1.2 R25#1.2 T1.4(SOURCE2) T1.6(SOURCE2) ; port BAT+
NetR23#1_2: R23#1.2 U4#1.6(PACK)
NetR25#1_1: R25#1.1 U4#1.1(BAT)
NetR26#1_1: R26#1.1 ; port OVERRIDE
NetT1_2: T1.2(GATE1) U4#1.7(DSG)
NetT1_5: T1.5(GATE2) U4#1.8(CHG)

### Notes on the sheet
- Подп. и дата
- Инв. № дубл.
- Взам. инв. №
- Инв. № подл.
- Изм.
- Лист
- № докум.
- Подп.
- Дата
- Форма 2а ГОСТ 2.104-2006
- Копировал
- Формат А4

### Library data of the parts
C7 C8#2 = Capacitor: as C9#1 on sheet mboard_usb; Value: 0.1мкФ
R23#1 R24#1 R25#1 R26#1 R27#1 = Resistor: as R16 on sheet mboard_pwr_harvewster
  R23: Value: 1к
  R24: Value: 300
  R25: Value: 20
  R26 R27: Value: 100
R28#1 = Resistor: as R29#1 on sheet mboard_usb; Value: 10мОм 1% 100ppm/°C
T1 = EFC8811R-TF: Dual N-Channel power MOSFET; Потребление, Вт: 0.001; Назначение: Dual N-Channel power MOSFET; ComponentLink1Description: DataSheet; ComponentLink1URL: https://www.farnell.com/datasheets/2197419.pdf; Наименование: EFC8811R-TF
U4#1 = BQ2980xy: Voltage, Current, Temperature Protectors with an Integrated High-Side / NFET Driver for Fast/Flash Charging Single-Cell Li-Ion and Li-Polymer Batteries; Потребление, Вт: 0.001; Наименование: BQ298000RUG; Назначение: Voltage, Current, Temperature Protectors with an Integrated High-Side; ComponentLink1Description: DataSheet; ComponentLink1URL: https://www.ti.com/lit/ds/symlink/bq2980.pdf?ts=1635593723857&ref_url=https%253A%252F%252Fwww.ti.com%252Fproduct%252FBQ2980

## Sheet mboard_pwr_fuse.SchDoc: =GlobalProjectName
size 209 x 297 mm; SheetNumber: 17; SheetTotal: 17; PageSetup: Record=PageOptions|CenterHorizontal=True|CenterVertical=True|PrintScale=1.00|XCorrection=1.00|YCorrection=1.00|PrintKind=1|BorderSize=5000000|LeftOffset=0|BottomOffset=0|Orientation=2|PaperLength=1000|PaperWidth=1000|Scale=100|PaperSource=15|PrintQuality=1200|MediaType=1|DitherType=10|PaperKind=A3|PrintScaleMode=1; Weight: -; ScaleFactor: -
Used 6 times, as channels eFuse_1, eFuse_2, eFuse_3, eFuse_4, eFuse_5, eFuse_6. Parts and nets are listed once, with the designators drawn on the sheet.
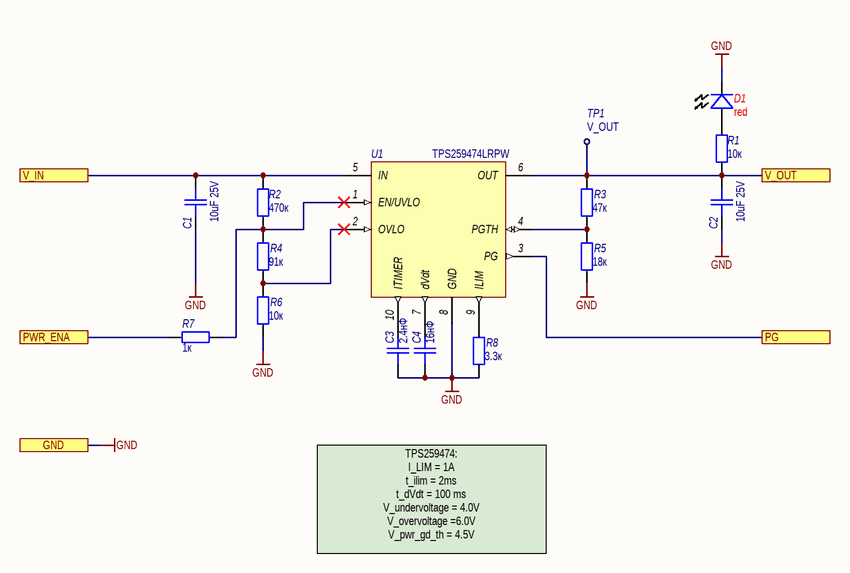
[diagram p5: mboard_pwr_fuse.SchDoc]

### Parts
D1  value red  [LED_0402_RED]  (hidden comment: LED)
R1  10к  [SMD_0603]
R2  470к  [SMD_0603]
R3  47к  [SMD_0603]
R4  91к  [SMD_0603]
R5  18к  [SMD_0603]
R6  10к  [SMD_0603]
R7  1к  [SMD_0603]
R8  3.3к  [SMD_0603]
TP1  V_OUT  [TestPoint]
U1  Наименование: TPS259474LRPW  [VQFN-HR-10]  (hidden comment: TPS25947x)
С1  10uF 25V  [SMD_C0603]
С2  10uF 25V  [SMD_C0603]
С3  2.4нФ  [SMD_C0603]
С4  16нФ  [SMD_C0603]

### Ports
GND, PG, PWR_ENA, V_IN, V_OUT

### Nets
GND: D1.2(K) R5.1 R6.1 R8.1 U1.8(GND) С1.1 С2.1 С3.1 С4.1 ; port GND
PG: U1.3(PG) ; port PG
PWR_ENA: R7.R? ; port PWR_ENA
V_IN: R2.2 U1.5(IN) С1.2 ; port V_IN
V_OUT: R1.2 R3.2 TP1.0(TP) U1.6(OUT) С2.2 ; port V_OUT
NetD1_1: D1.1(A) R1.1
NetR2_1: R2.1 R4.2 R7.1 U1.1(EN/UVLO)
NetR3_1: R3.1 R5.2 U1.4(PGTH)
NetR4_1: R4.1 R6.2 U1.2(OVLO)
NetR8_2: R8.2 U1.9(ILIM)
NetU1_7: U1.7(dVdt) С4.2
NetU1_10: U1.10(ITIMER) С3.2

### Channels
eFuse_1: designators D1=D3 R1=R31#2 R2=R32#2 R3=R33#2 R4=R34#2 R5=R35#2 R6=R36#2 R7=R37#2 R8=R38#2 TP1=TP3#2 U1=U5#2 С1=С9 С2=С10 С3=С11 С4=С12; ports GND=GND PG=NetU5#2_3 PWR_ENA=NetR37#2_R? V_IN=NetC9#2_2 V_OUT=NetC10#1_2
eFuse_2: designators D1=D1 R1=R15#1 R2=R16 R3=R17 R4=R18 R5=R19 R6=R20 R7=R21 R8=R22 TP1=TP1 U1=U3 С1=С1 С2=С2 С3=С3 С4=С4; ports GND=GND PG=NetU3_3 PWR_ENA=NetR21_R? V_IN=NetC14#2_2 V_OUT=NetC10#1_2
eFuse_3: designators D1=D2 R1=R23#2 R2=R24#2 R3=R25#2 R4=R26#2 R5=R27#2 R6=R28#2 R7=R29#2 R8=R30#2 TP1=TP2#2 U1=U4#2 С1=С5 С2=С6 С3=С7 С4=С8; ports GND=GND PG=NetU4#2_3 PWR_ENA=NetR29#2_R? V_IN=NetC19#1_2 V_OUT=NetC10#1_2
eFuse_4: designators D1=D4 R1=R78 R2=R79 R3=R80 R4=R81 R5=R82 R6=R83 R7=R84 R8=R85 TP1=TP6 U1=U15 С1=С17 С2=С18 С3=С19 С4=С20; ports GND=GND PG=NetU15_3 PWR_ENA=PWR_CH_2 V_IN=NetC10#1_2 V_OUT=NetR9_2
eFuse_5: designators D1=D5 R1=R86 R2=R87 R3=R88 R4=R89 R5=R90 R6=R91 R7=R92 R8=R93 TP1=TP7 U1=U16 С1=С21 С2=С22 С3=С23 С4=С24; ports GND=GND PG=NetU16_3 PWR_ENA=PWR_CH_1 V_IN=NetC10#1_2 V_OUT=NetR10_2
eFuse_6: designators D1=D6 R1=R94 R2=R95 R3=R96 R4=R97 R5=R98 R6=R99 R7=R100 R8=R101 TP1=TP8 U1=U17 С1=С25 С2=С26 С3=С27 С4=С28; ports GND=GND PG=NetU17_3 PWR_ENA=PWR_CH_0 V_IN=NetC10#1_2 V_OUT=NetR11_2

### Notes on the sheet
- TPS259474:
  I_LIM = 1A
  t_ilim = 2ms
  t_dVdt = 100 ms
  V_undervoltage = 4.0V
  V_overvoltage =6.0V
  V_pwr_gd_th = 4.5V
- Подп. и дата
- Инв. № дубл.
- Взам. инв. №
- Инв. № подл.
- Изм.
- Лист
- № докум.
- Подп.
- Дата
- Форма 2а ГОСТ 2.104-2006
- Копировал
- Формат А4

### Library data of the parts
D1 = LED: as R31#1 on sheet mboard_usb
R1-R8 = Resistor: as R16 on sheet mboard_pwr_harvewster
  R1 R6: Value: 10к
  R2: Value: 470к
  R3: Value: 47к
  R4: Value: 91к
  R5: Value: 18к
  R7: Value: 1к
  R8: Value: 3.3к
TP1 = TP: as TP2#1 on sheet mboard_usb; TP_Name: V_OUT
U1 = TPS25947x: TPS25947xx, 2.7 - 23 V, 5.5 A, 28-mΩ True Reverse Current Blocking eFuse with Input / Reverse Polarity Protection; Потребление, Вт: 0,05; Назначение: 2.7 - 23 V, 5.5 A, 28-mΩ True Reverse Current Blocking eFuse with Input; ComponentLink1Description: DataSheet; ComponentLink1URL: https://www.ti.com/lit/ds/symlink/tps25947.pdf?ts=1621925066842&ref_url=https%253A%252F%252Fwww.ti.com%252Fproduct%252FTPS25947%253FkeyMatch%253DTPS25947%2526tisearch%253Dsearch-everything%2526usecase%253DGPN
С1 С2 = Capacitor: SMD 0603; Наименование: Конденсатор; Потребление, Вт: 0; Точность: 20%; Напряжение: 25В; Назначение: SMD 0603; Value: 10uF 25V
С3 С4 = Capacitor: Назначение: SMD-конденсатор; Наименование: Конденсатор; Потребление, Вт: 0; Точность: %; Напряжение: В; Диэлектрик: *
  С3: Value: 2.4нФ
  С4: Value: 16нФ

## Sheet mboard_rf.SchDoc: =GlobalProjectName
size 410 x 297 mm; SheetNumber: Лист; SheetTotal: Листов; PageSetup: Record=PageOptions|CenterHorizontal=True|CenterVertical=True|PrintScale=1.00|XCorrection=1.00|YCorrection=1.00|PrintKind=1|BorderSize=5000000|LeftOffset=0|BottomOffset=0|Orientation=2|PaperLength=1000|PaperWidth=1000|Scale=100|PaperSource=15|PrintQuality=1200|MediaType=1|DitherType=10|PaperKind=A3|PrintScaleMode=1; Weight: -; ScaleFactor: -
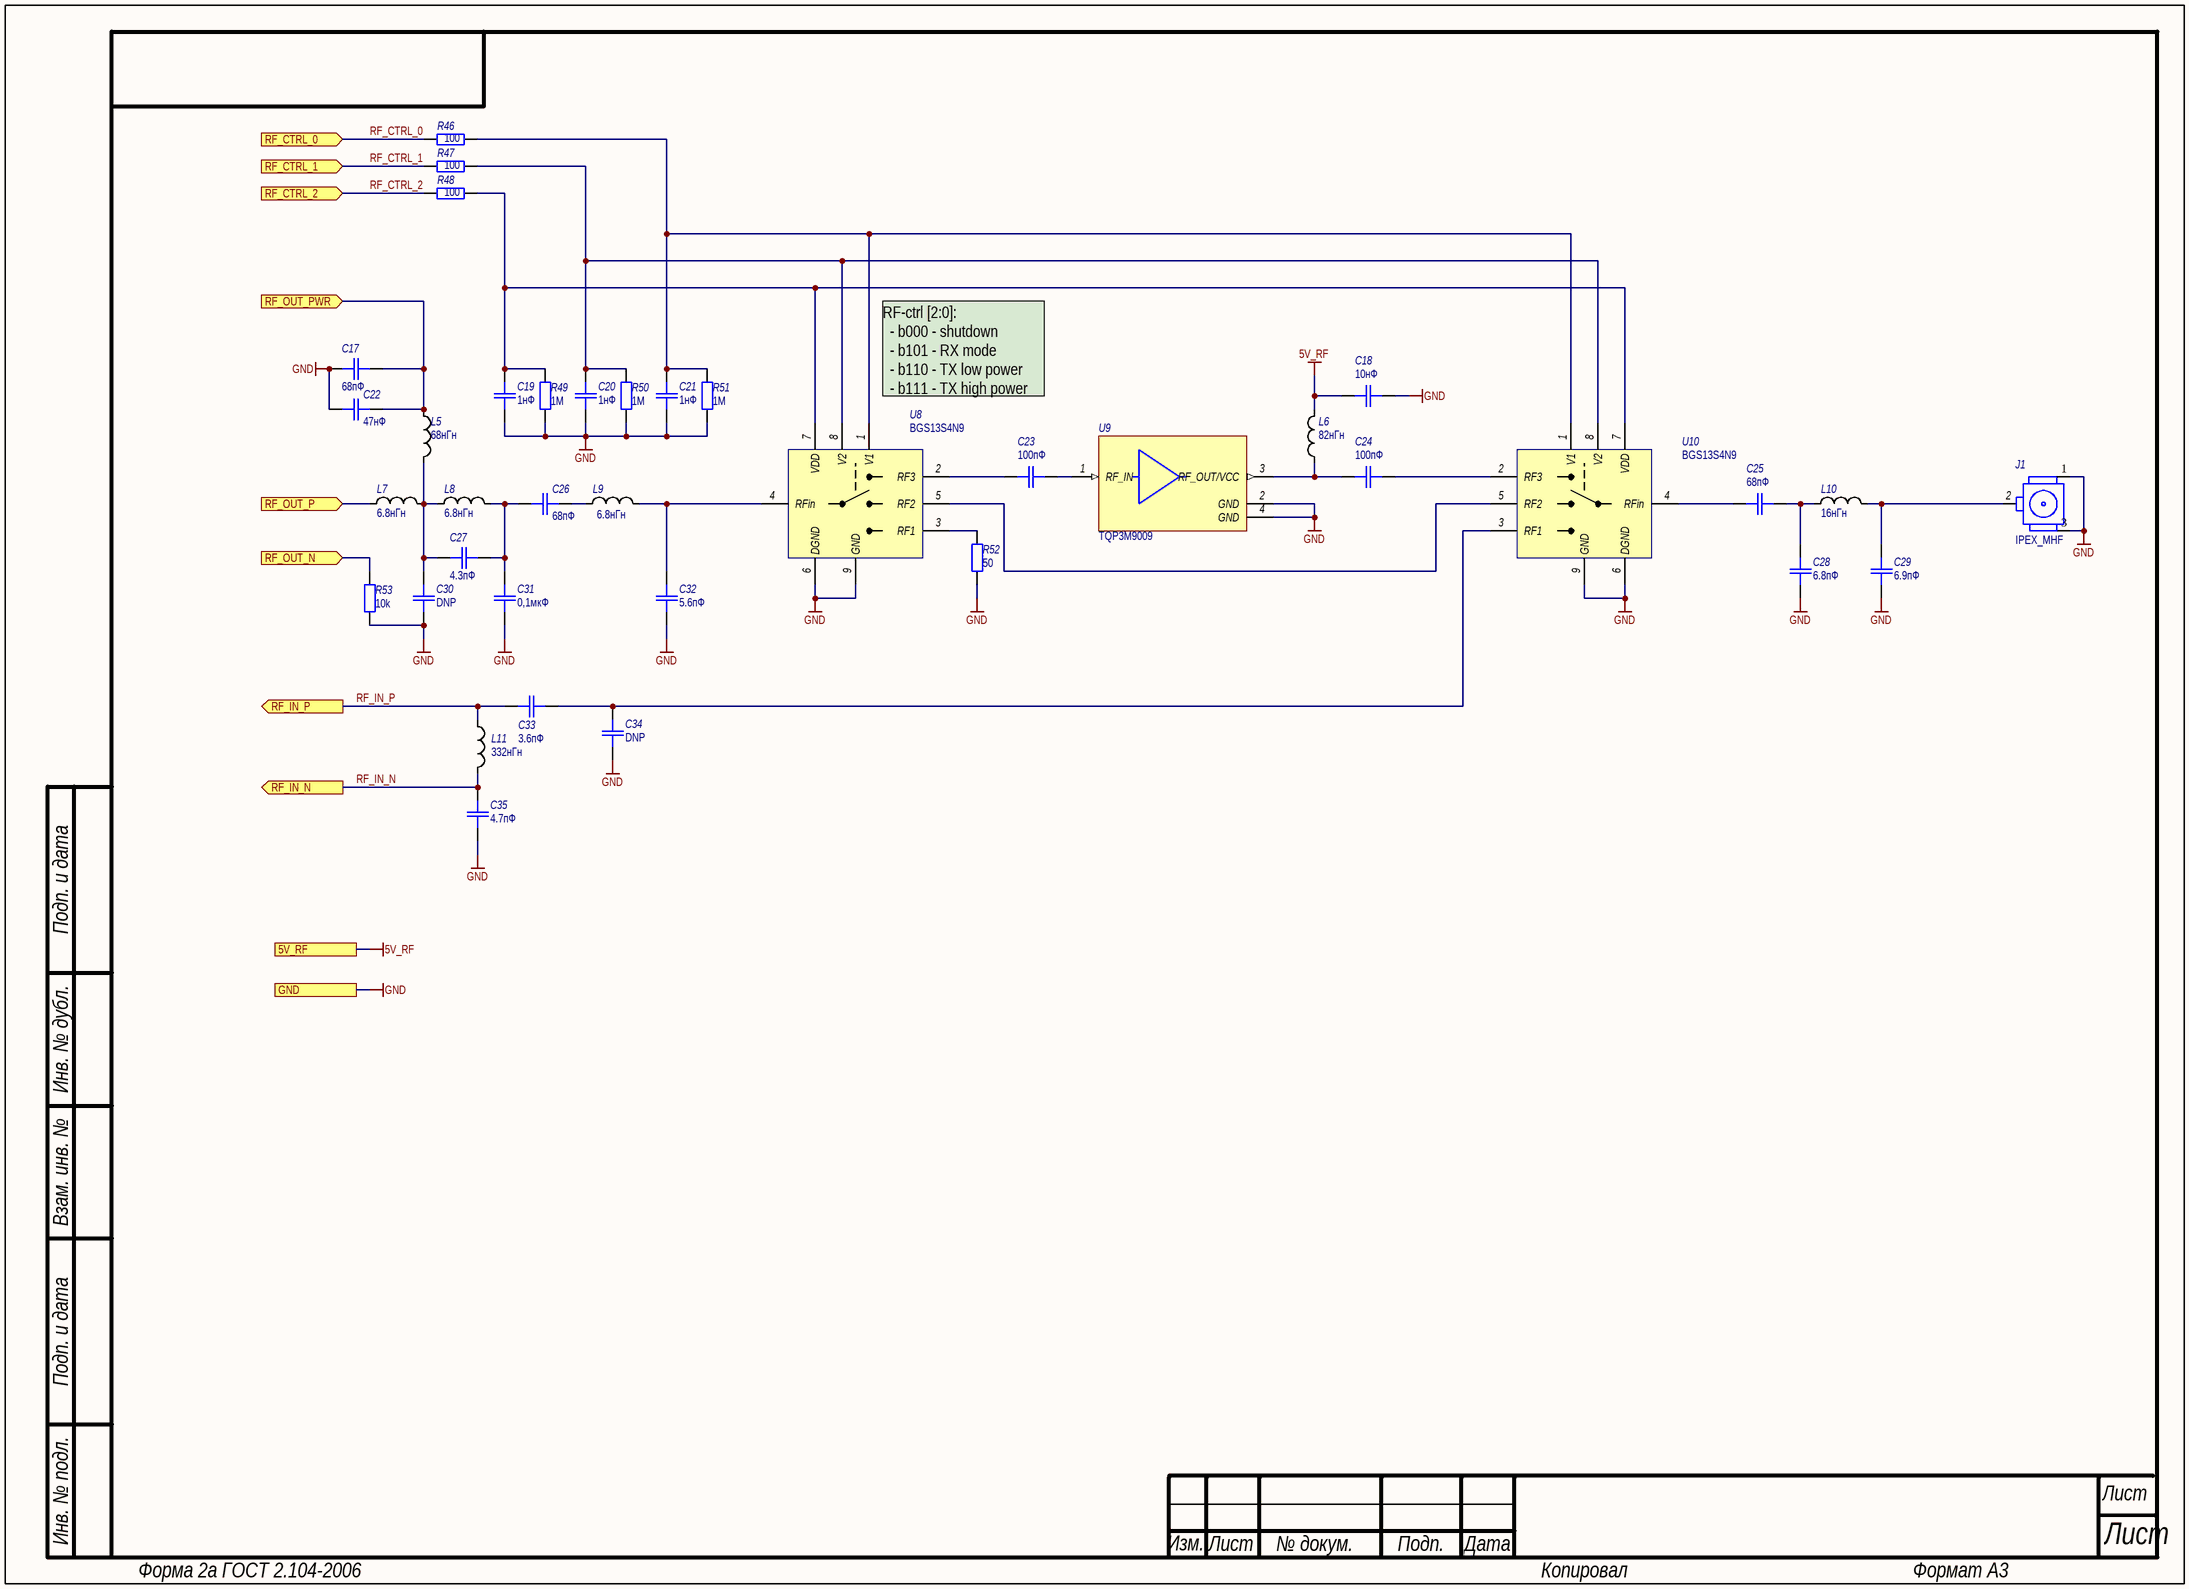
[diagram p6: mboard_rf.SchDoc]

### Parts
(Parts that share a designator on the sheet are numbered #1, #2 ... from top to bottom, then left to right.)
C17#2  value 68пФ  [SMD_C0603]  (hidden comment: K10-79)
C18#2  value 10нФ  [SMD_C0603]  (hidden comment: K10-79)
C19#2  value 1нФ  [SMD_C0402]  (hidden comment: K10-79)
C20#2  value 1нФ  [SMD_C0402]  (hidden comment: K10-79)
C21#2  value 1нФ  [SMD_C0402]  (hidden comment: K10-79)
C22#2  value 47нФ  [SMD_C0603]  (hidden comment: K10-79)
C23  value 100пФ  [SMD_C0402]  (hidden comment: K10-79)
C24  value 100пФ  [SMD_C0603]  (hidden comment: K10-79)
C25  value 68пФ  [SMD_C0603]  (hidden comment: K10-79)
C26  value 68пФ  [SMD_C0603]  (hidden comment: K10-79)
C27  value 4.3пФ  [SMD_C0402]  (hidden comment: K10-79)
C28  value 6.8пФ  [SMD_C0603]  (hidden comment: K10-79)
C29  value 6.9пФ  [SMD_C0603]  (hidden comment: K10-79)
C30  value DNP  [SMD_C0402]  (hidden comment: K10-79)
C31  value 0,1мкФ  [SMD_C0402]  (hidden comment: K10-79)
C32  value 5.6пФ  [SMD_C0603]  (hidden comment: K10-79)
C33  value 3.6пФ  [SMD_C0603]  (hidden comment: K10-79)
C34  value DNP  [SMD_C0603]  (hidden comment: K10-79)
C35  value 4.7пФ  [SMD_C0603]  (hidden comment: K10-79)
J1  IPEX_MHF  [IPEX_MHF]
L5  value 68нГн  [SMD_0805]  (hidden comment: Inductor)
L6  value 82нГн  [SMD_0805]  (hidden comment: Inductor)
L7#1  value 6.8нГн  [SMD_0805]  (hidden comment: Inductor)
L8#1  value 6.8нГн  [SMD_0805]  (hidden comment: Inductor)
L9  value 6.8нГн  [SMD_0805]  (hidden comment: Inductor)
L10  value 16нГн  [SMD_0805]  (hidden comment: Inductor)
L11  value 332нГн  [SMD_0805]  (hidden comment: Inductor)
R46#2  value 100  [SMD_0805]  (hidden comment: OSM R1-12)
R47#2  value 100  [SMD_0805]  (hidden comment: OSM R1-12)
R48#2  value 100  [SMD_0805]  (hidden comment: OSM R1-12)
R49#2  value 1M  [SMD_0805]  (hidden comment: OSM R1-12)
R50#2  value 1M  [SMD_0805]  (hidden comment: OSM R1-12)
R51#2  value 1M  [SMD_0805]  (hidden comment: OSM R1-12)
R52#2  value 50  [SMD_0805]  (hidden comment: OSM R1-12)
R53#2  value 10k  [SMD_0805]  (hidden comment: OSM R1-12)
U8  BGS13S4N9  [TSNP-9-3]
U9  High Linearity LNA Gain Block  [SOT89]  (value not drawn)
U10  BGS13S4N9  [TSNP-9-3]

### Ports
5V_RF, GND, RF_CTRL_0 (in), RF_CTRL_1 (in), RF_CTRL_2 (in), RF_IN_N (out), RF_IN_P (out), RF_OUT_N (in), RF_OUT_P (in), RF_OUT_PWR (in)

### Nets
5V_RF: C18#2.1 L6.2 ; port 5V_RF
GND: C17#2.2 C18#2.2 C19#2.1 C20#2.1 C21#2.1 C22#2.1 C28.1 C29.1 C30.2 C31.2 C32.2 C34.1 C35.2 J1.1 J1.3 R49#2.2 R50#2.2 R51#2.2 R52#2.2 R53#2.1 R53#2.2 U8.6(DGND) U8.9(GND) U9.2(GND) U9.4(GND) U10.6(DGND) U10.9(GND) ; port RF_OUT_N, port GND
RF_CTRL_0: R46#2.1 ; port RF_CTRL_0
RF_CTRL_1: R47#2.1 ; port RF_CTRL_1
RF_CTRL_2: R48#2.1 ; port RF_CTRL_2
RF_IN_N: C35.1 L11.2 ; port RF_IN_N
RF_IN_P: C33.1 L11.1 ; port RF_IN_P
NetC17#2_1: C17#2.1 C22#2.2 L5.2 ; port RF_OUT_PWR
NetC19#2_2: C19#2.2 R48#2.2 R49#2.1 U8.7(VDD) U10.7(VDD)
NetC20#2_2: C20#2.2 R47#2.2 R50#2.1 U8.8(V2) U10.8(V2)
NetC21#2_2: C21#2.2 R46#2.2 R51#2.1 U8.1(V1) U10.1(V1)
NetC23_1: C23.1 U8.2(RF3)
NetC23_2: C23.2 U9.1(RF_IN)
NetC24_1: C24.1 L6.1 U9.3(RF_OUT/VCC)
NetC24_2: C24.2 U10.2(RF3)
NetC25_1: C25.1 U10.4(RFin)
NetC25_2: C25.2 C28.2 L10.1
NetC26_1: C26.1 C27.2 C31.1 L8#1.1
NetC26_2: C26.2 L9.1
NetC27_1: C27.1 C30.1 L5.1 L7#1.1 L8#1.2
NetC29_2: C29.2 J1.2 L10.2
NetC32_1: C32.1 L9.2 U8.4(RFin)
NetC33_2: C33.2 C34.2 U10.3(RF1)
NetL7#1_2: L7#1.2 ; port RF_OUT_P
NetR52#2_1: R52#2.1 U8.3(RF1)
NetU8_5: U8.5(RF2) U10.5(RF2)

### Notes on the sheet
- RF-ctrl [2:0]:
  - b000 - shutdown
  - b101 - RX mode
  - b110 - TX low power
  - b111 - TX high power
- Подп. и дата
- Инв. № дубл.
- Взам. инв. №
- Инв. № подл.
- Изм.
- Лист
- № докум.
- Подп.
- Дата
- Форма 2а ГОСТ 2.104-2006
- Копировал
- Формат А3

### Library data of the parts
C17#2 C18#2 C19#2 C20#2 C21#2 C22#2 C23-C35 = Capacitor: as C16#1 on sheet mboard_mcu; Диэлектрик: *
J1 = IPEX_MHF: RF Connector, Onboard Receptacle, IPEX MHF, 3x3mm; Потребление, Вт: 0.0; ComponentLink2URL: https://static.chipdip.ru/lib/947/DOC011947657.pdf; ComponentLink2Description: Datasheet; Назначение: RF Connector, Onboard Receptacle, IPEX MHF, 3x3mm; Наименование: IPEX_MHF
L5 L6 L7#1 L8#1 L9-L11 = Inductor: as L4#1 on sheet mboard_mcu
R46#2 R47#2 R48#2 R49#2 R50#2 R51#2 R52#2 R53#2 = Resistor: as R40#1 on sheet mboard_mcu
U8 U10 = BGS13S4N9: Wideband RF SP3T Switch; Internal_Part_Number: MCD-02018; Part_Type: IC; Manufacturer: INFINEON; ECCN_US: EAR99; ECCN_EU: tbd; Provided_By: SUBCO; Потребление, Вт: 0.001; Status: Checked; Manufacturer_Part_Number: BGS13S4N9; Package: TSNP-9-3; ComponentLink1Description: Datasheet; ComponentLink1URL: http://tunmcdsvn.tun.st.com/Component_Datasheet_Library/Trunk/IC/Infineon_SP3T_BGS13S4N9/Infineon-BGS13S4N9-DS-v01_00-EN.pdf; Value: BGS13S4N9; Назначение: Wideband RF SP3T Switch; Наименование: BGS13S4N9
U9 = TQP3M9009: Потребление, Вт: 0.5; Назначение: High Linearity LNA Gain Block; ComponentLink1Description: DataSheet; ComponentLink1URL: https://ru.mouser.com/datasheet/2/412/TQP3M9009-189509.pdf; Название: TQP3M9009

## Sheet mboard_dcdc.SchDoc: =GlobalProjectName
size 209 x 297 mm; SheetNumber: Лист; SheetTotal: Листов; PageSetup: Record=PageOptions|CenterHorizontal=True|CenterVertical=True|PrintScale=1.00|XCorrection=1.00|YCorrection=1.00|PrintKind=1|BorderSize=5000000|LeftOffset=0|BottomOffset=0|Orientation=2|PaperLength=1000|PaperWidth=1000|Scale=100|PaperSource=15|PrintQuality=1200|MediaType=1|DitherType=10|PaperKind=A3|PrintScaleMode=1; Weight: -; ScaleFactor: -
Used 2 times, as channels VBat-5V0, VBat-3V3. Parts and nets are listed once, with the designators drawn on the sheet.
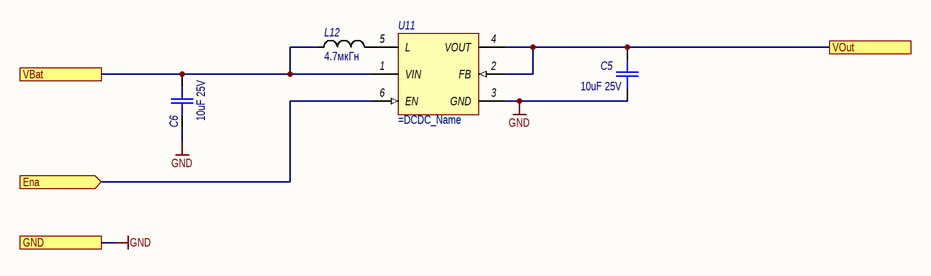
[diagram p7: mboard_dcdc.SchDoc]

### Parts
L12  value 4.7мкГн  [SMD_0805]  (hidden comment: Inductor)
U11  TPS61222  [SC-70_6]  (value not drawn)
С5  10uF 25V  [SMD_C0603]
С6  10uF 25V  [SMD_C0603]

### Ports
Ena (in), GND, VBat, VOut

### Nets
GND: U11.3(GND) С5.1 С6.1 ; port GND
Ena: U11.6(EN) ; port Ena
VBat: L12.1 U11.1(VIN) С6.2 ; port VBat
VOut: U11.2(FB) U11.4(VOUT) С5.2 ; port VOut
NetL12_2: L12.2 U11.5(L)

### Channels
VBat-5V0: designators L12=L8#2 U11=U11_VBat-5V0 С5=С15 С6=С16; ports Ena=RF_AMP_PWR_CTRL GND=GND VBat=NetL7#2_1 VOut=5V_RF
VBat-3V3: designators L12=L7#2 U11=U11_VBat-3V3 С5=С13 С6=С14; ports Ena=NetL7#2_1 GND=GND VBat=NetL7#2_1 VOut=NetU11_VBat-3V3_2

### Notes on the sheet
- Подп. и дата
- Инв. № дубл.
- Взам. инв. №
- Инв. № подл.
- Изм.
- Лист
- № докум.
- Подп.
- Дата
- Форма 2а ГОСТ 2.104-2006
- Копировал
- Формат А4

### Library data of the parts
L12 = Inductor: as L4#1 on sheet mboard_mcu
U11 = TPS6122x: Boost Voltage Converter with 0.7 to 5.5 V Input and 5 V Output, -40 to 85 degC, 6-Pin SC70 (DCK), Green (RoHS & no Sb/Br); Потребление, Вт: 0.01; ComponentLink1URL: http://www.ti.com/general/docs/lit/getliterature.tsp?genericPartNumber=TPS61222&fileType=pdf; ComponentLink2Description: Package Specification; ComponentLink1Description: Datasheet; ComponentLink2URL: http://www.ti.com/litv/pdf/mpds114c; Назначение: Boost Voltage Converter with 0.7 to 5.5 V Input and 5 V Output; Наименование: =DCDC_Name
С5 С6 = Capacitor: as С1 on sheet mboard_pwr_fuse; Назначение: SMD 0603; Value: 10uF 25V

## Sheet mboard_pwr_ctrl.SchDoc: =GlobalProjectName
size 209 x 297 mm; SheetNumber: Лист; SheetTotal: Листов; PageSetup: Record=PageOptions|CenterHorizontal=True|CenterVertical=True|PrintScale=1.00|XCorrection=1.00|YCorrection=1.00|PrintKind=1|BorderSize=5000000|LeftOffset=0|BottomOffset=0|Orientation=2|PaperLength=1000|PaperWidth=1000|Scale=100|PaperSource=15|PrintQuality=1200|MediaType=1|DitherType=10|PaperKind=A3|PrintScaleMode=1; Weight: -; ScaleFactor: -
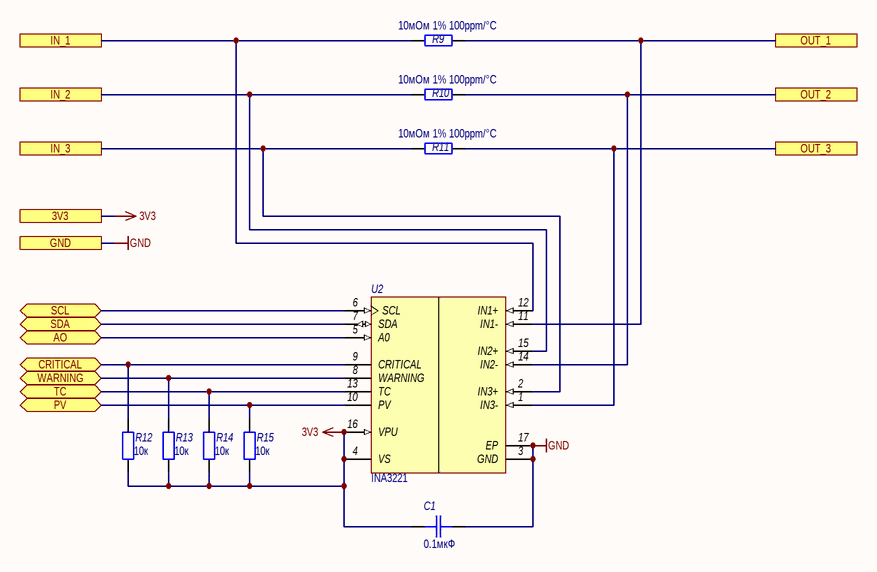
[diagram p8: mboard_pwr_ctrl.SchDoc]

### Parts
(Parts that share a designator on the sheet are numbered #1, #2 ... from top to bottom, then left to right.)
C1  0.1мкФ  [SMD_C0603]
R9  10мОм 1% 100ppm/°C  [SMD_0805]
R10  10мОм 1% 100ppm/°C  [SMD_0805]
R11  10мОм 1% 100ppm/°C  [SMD_0805]
R12  10к  [SMD_0603]
R13  10к  [SMD_0603]
R14  10к  [SMD_0603]
R15#2  10к  [SMD_0603]
U2  INA3221  [VQFN-16]

### Ports
3V3, AO (bidir), CRITICAL (bidir), GND, IN_1, IN_2, IN_3, OUT_1, OUT_2, OUT_3, PV (bidir), SCL (bidir), SDA (bidir), TC (bidir), WARNING (bidir)

### Nets
3V3: C1.2 R12.1 R13.1 R14.1 R15#2.1 U2.4(VS) U2.16(VPU) ; port 3V3
GND: C1.1 U2.3(GND) U2.5(A0) U2.17(EP) ; port AO, port GND
SYS_I2C_SCL: U2.6(SCL) ; port SCL
SYS_I2C_SDA: U2.7(SDA) ; port SDA
NetL7#2_1: R11.1 U2.1(IN3-) ; port OUT_3
NetP1_1: R9.1 U2.11(IN1-) ; port OUT_1
NetP4_1: R10.1 U2.14(IN2-) ; port OUT_2
NetR9_2: R9.2 U2.12(IN1+) ; port IN_1
NetR10_2: R10.2 U2.15(IN2+) ; port IN_2
NetR11_2: R11.2 U2.2(IN3+) ; port IN_3
NetR12_2: R12.2 U2.9(CRITICAL) ; port CRITICAL
NetR13_2: R13.2 U2.8(WARNING) ; port WARNING
NetR14_2: R14.2 U2.13(TC) ; port TC
NetR15#2_2: R15#2.2 U2.10(PV) ; port PV

### Notes on the sheet
- Подп. и дата
- Инв. № дубл.
- Взам. инв. №
- Инв. № подл.
- Изм.
- Лист
- № докум.
- Подп.
- Дата
- Форма 2а ГОСТ 2.104-2006
- Копировал
- Формат А4

### Library data of the parts
C1 = Capacitor: as C9#1 on sheet mboard_usb; Value: 0.1мкФ
R9-R11 = Resistor: as R29#1 on sheet mboard_usb; Value: 10мОм 1% 100ppm/°C
R12-R14 R15#2 = Resistor: as R16 on sheet mboard_pwr_harvewster; Value: 10к
U2 = INA3221: Triple-Channel, High-Side Measurement, / Shunt and Bus Voltage Monitor with I2C- and SMBUS-Compatible Interface; Потребление, Вт: 0.001; ComponentLink1Description: Data sheet; ComponentLink1URL: https://www.ti.com/lit/ds/symlink/ina3221.pdf?ts=1635579800802&ref_url=https%253A%252F%252Fwww.ti.com%252Fproduct%252FINA3221; Назначение: Triple-Channel, High-Side Measurement,; Supplier Part Number 1: INA3221AIRGVT; Наименование: INA3221

## Sheet mboard_mem.SchDoc: =GlobalProjectName
size 209 x 297 mm; SheetNumber: Лист; SheetTotal: Листов; PageSetup: Record=PageOptions|CenterHorizontal=True|CenterVertical=True|PrintScale=1.00|XCorrection=1.00|YCorrection=1.00|PrintKind=1|BorderSize=5000000|LeftOffset=0|BottomOffset=0|Orientation=2|PaperLength=1000|PaperWidth=1000|Scale=100|PaperSource=15|PrintQuality=1200|MediaType=1|DitherType=10|PaperKind=A3|PrintScaleMode=1; Weight: -; ScaleFactor: -
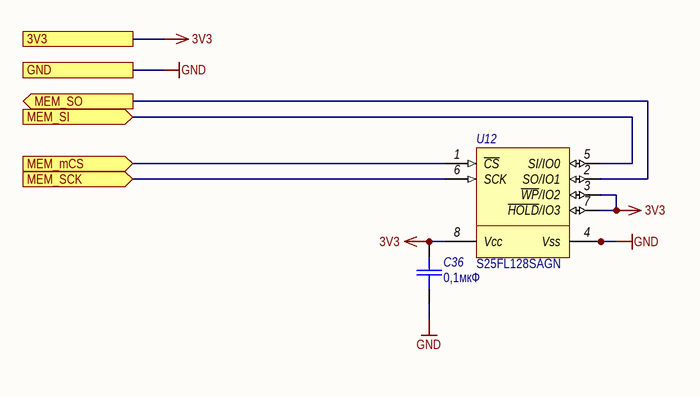
[diagram p9: mboard_mem.SchDoc]

### Parts
C36  value 0,1мкФ  [SMD_C0402]  (hidden comment: K10-79)
U12  S25FL128SAGN  [WSON-8_6x8]

### Ports
3V3, GND, MEM_mCS (in), MEM_SCK (in), MEM_SI (in), MEM_SO (out)

### Nets
3V3: C36.1 U12.3(~{WP}/IO2) U12.7(~{HOLD}/IO3) U12.8(Vcc) ; port 3V3
GND: C36.2 U12.4(Vss) U12.9(TP) ; port GND
SPI1_MISO: U12.2(SO/IO1) ; port MEM_SO
SPI1_MOSI: U12.5(SI/IO0) ; port MEM_SI
SPI1_NSS: U12.1(~{CS}) ; port MEM_mCS
SPI1_SCK: U12.6(SCK) ; port MEM_SCK

### Notes on the sheet
- Подп. и дата
- Инв. № дубл.
- Взам. инв. №
- Инв. № подл.
- Изм.
- Лист
- № докум.
- Подп.
- Дата
- Форма 2а ГОСТ 2.104-2006
- Копировал
- Формат А4

### Library data of the parts
C36 = Capacitor: as C16#1 on sheet mboard_mcu; Диэлектрик: *
U12 = S25FL128SAGN: Programmable NOR flash memory; Потребление, Вт: 0.1; Назначение: Programmable NOR flash memory; ComponentLink1Description: DataSheet; ComponentLink1URL: https://www.infinite-electronic.ru/datasheet/8b-S25FL256SAGBHV203.pdf; Supplier 1: Digi-Key; Supplier Part Number 1: 428-4618-ND; Наименование: S25FL128SAGN

## Nets that join several sheets
3V3: mboard (P7.1), mboard_mcu (15 pins), mboard_usb (C13#1.2 U6.9), mboard_pwr_ctrl (7 pins), mboard_mem (C36.1 U12.3 U12.7 U12.8)
3V3_LDO: SolarPanel_Input_1 (C10#2.2 R40#2.2 R45#2.2 U3_SolarPanel_Input_1.2), SolarPanel_Input_2 (C15#2.2 R47#1.2 R52#1.2 U3_SolarPanel_Input_2.2), SolarPanel_Input_3 (C20#1.2 R54#2.2 R59.2 U3_SolarPanel_Input_3.2)
5V_RF: mboard_rf (C18#2.1 L6.2), VBat-5V0 (U11_VBat-5V0.2 U11_VBat-5V0.4 С15.2)
GND: mboard (25 pins), mboard_mcu (11 pins), mboard_usb (19 pins), SolarPanel_Input_1 (10 pins), mboard_battery (C8#2.2 R27#1.2 R28#1.2 U4#1.4), SolarPanel_Input_2 (10 pins), SolarPanel_Input_3 (10 pins), eFuse_1 (9 pins), eFuse_2 (9 pins), eFuse_3 (9 pins), eFuse_4 (9 pins), eFuse_5 (9 pins), eFuse_6 (9 pins), mboard_rf (27 pins), VBat-5V0 (U11_VBat-5V0.3 С15.1 С16.1), VBat-3V3 (U11_VBat-3V3.3 С13.1 С14.1), mboard_pwr_ctrl (C1.1 U2.3 U2.5 U2.17), mboard_mem (C36.2 U12.4 U12.9)
MCU_VCP_RX: mboard_mcu (U7.10), mboard_usb (TP2#1.0 U6.7)
MCU_VCP_TX: mboard_mcu (U7.9), mboard_usb (TP3#1.0 U6.10)
NetC7_2: mboard (P6.3 P6.4), mboard_battery (C7.2 R28#1.1 U4#1.3)
NetC8#1_1: mboard (P2.1 P2.2), SolarPanel_Input_1 (C8#1.1 L2#2.2 U3_SolarPanel_Input_1.6)
NetC9#2_2: SolarPanel_Input_1 (C9#2.2 R39#2.2 U3_SolarPanel_Input_1.9), eFuse_1 (R32#2.2 U5#2.5 С9.2)
NetC10#1_2: mboard_usb (C10#1.2 U5#1.8), mboard_battery (R23#1.1 T1.1 T1.3), eFuse_1 (5 pins), eFuse_2 (5 pins), eFuse_3 (5 pins), eFuse_4 (R79.2 U15.5 С17.2), eFuse_5 (R87.2 U16.5 С21.2), eFuse_6 (R95.2 U17.5 С25.2)
NetC13#2_1: mboard (P3.1 P3.2), SolarPanel_Input_2 (C13#2.1 L3#2.2 U3_SolarPanel_Input_2.6)
NetC14#2_2: SolarPanel_Input_2 (C14#2.2 R46#1.2 U3_SolarPanel_Input_2.9), eFuse_2 (R16.2 U3.5 С1.2)
NetC17#2_1: mboard_mcu (U7.24), mboard_rf (C17#2.1 C22#2.2 L5.2)
NetC18#1_1: mboard (P5.1 P5.2), SolarPanel_Input_3 (C18#1.1 L4#2.2 U3_SolarPanel_Input_3.6)
NetC19#1_2: SolarPanel_Input_3 (C19#1.2 R53#1.2 U3_SolarPanel_Input_3.9), eFuse_3 (R24#2.2 U4#2.5 С5.2)
NetL7#1_2: mboard_mcu (R44#1.2 R45#1.2), mboard_rf (L7#1.2)
NetL7#2_1: VBat-5V0 (L8#2.1 U11_VBat-5V0.1 С16.2), VBat-3V3 (L7#2.1 U11_VBat-3V3.1 U11_VBat-3V3.6 С14.2), mboard_pwr_ctrl (R11.1 U2.1)
NetP1_1: mboard (P1.1 P1.2), mboard_pwr_ctrl (R9.1 U2.11)
NetP4_1: mboard (P4.1 P4.2), mboard_pwr_ctrl (R10.1 U2.14)
NetP6_1: mboard (P6.1 P6.2), mboard_battery (R24#1.2 R25#1.2 T1.4 T1.6)
NetR9_2: eFuse_4 (5 pins), mboard_pwr_ctrl (R9.2 U2.12)
NetR10_2: eFuse_5 (5 pins), mboard_pwr_ctrl (R10.2 U2.15)
NetR11_2: eFuse_6 (5 pins), mboard_pwr_ctrl (R11.2 U2.2)
PL_UART_RX: mboard (P1.3), mboard_mcu (U7.5)
PL_UART_TX: mboard (P1.4), mboard_mcu (U7.4)
PWR_CH_0: mboard_mcu (U7.12), eFuse_6 (R100.R?)
PWR_CH_1: mboard_mcu (U7.13), eFuse_5 (R92.R?)
PWR_CH_2: mboard_mcu (U7.14), eFuse_4 (R84.R?)
RF_AMP_PWR_CTRL: mboard_mcu (U7.43), VBat-5V0 (U11_VBat-5V0.6)
RF_CTRL_0: mboard_mcu (U7.6), mboard_rf (R46#2.1)
RF_CTRL_1: mboard_mcu (U7.7), mboard_rf (R47#2.1)
RF_CTRL_2: mboard_mcu (U7.8), mboard_rf (R48#2.1)
RF_IN_N: mboard_mcu (U7.21), mboard_rf (C35.1 L11.2)
RF_IN_P: mboard_mcu (U7.20), mboard_rf (C33.1 L11.1)
SPI1_MISO: mboard_mcu (U7.2), mboard_mem (U12.2)
SPI1_MOSI: mboard_mcu (U7.3), mboard_mem (U12.5)
SPI1_NSS: mboard_mcu (U7.31), mboard_mem (U12.1)
SPI1_SCK: mboard_mcu (U7.1), mboard_mem (U12.6)
SWCLK: mboard (P7.2), mboard_mcu (U7.42)
SWDIO: mboard (P7.3), mboard_mcu (U7.36)
SYS_I2C_SCL: mboard (P4.4), mboard_mcu (R41#1.1 U7.34), mboard_pwr_ctrl (U2.6)
SYS_I2C_SDA: mboard (P4.3), mboard_mcu (R40#1.1 U7.35), mboard_pwr_ctrl (U2.7)